# Altium project Speedometer_Tech.PrjPcb (part 1 of 2)
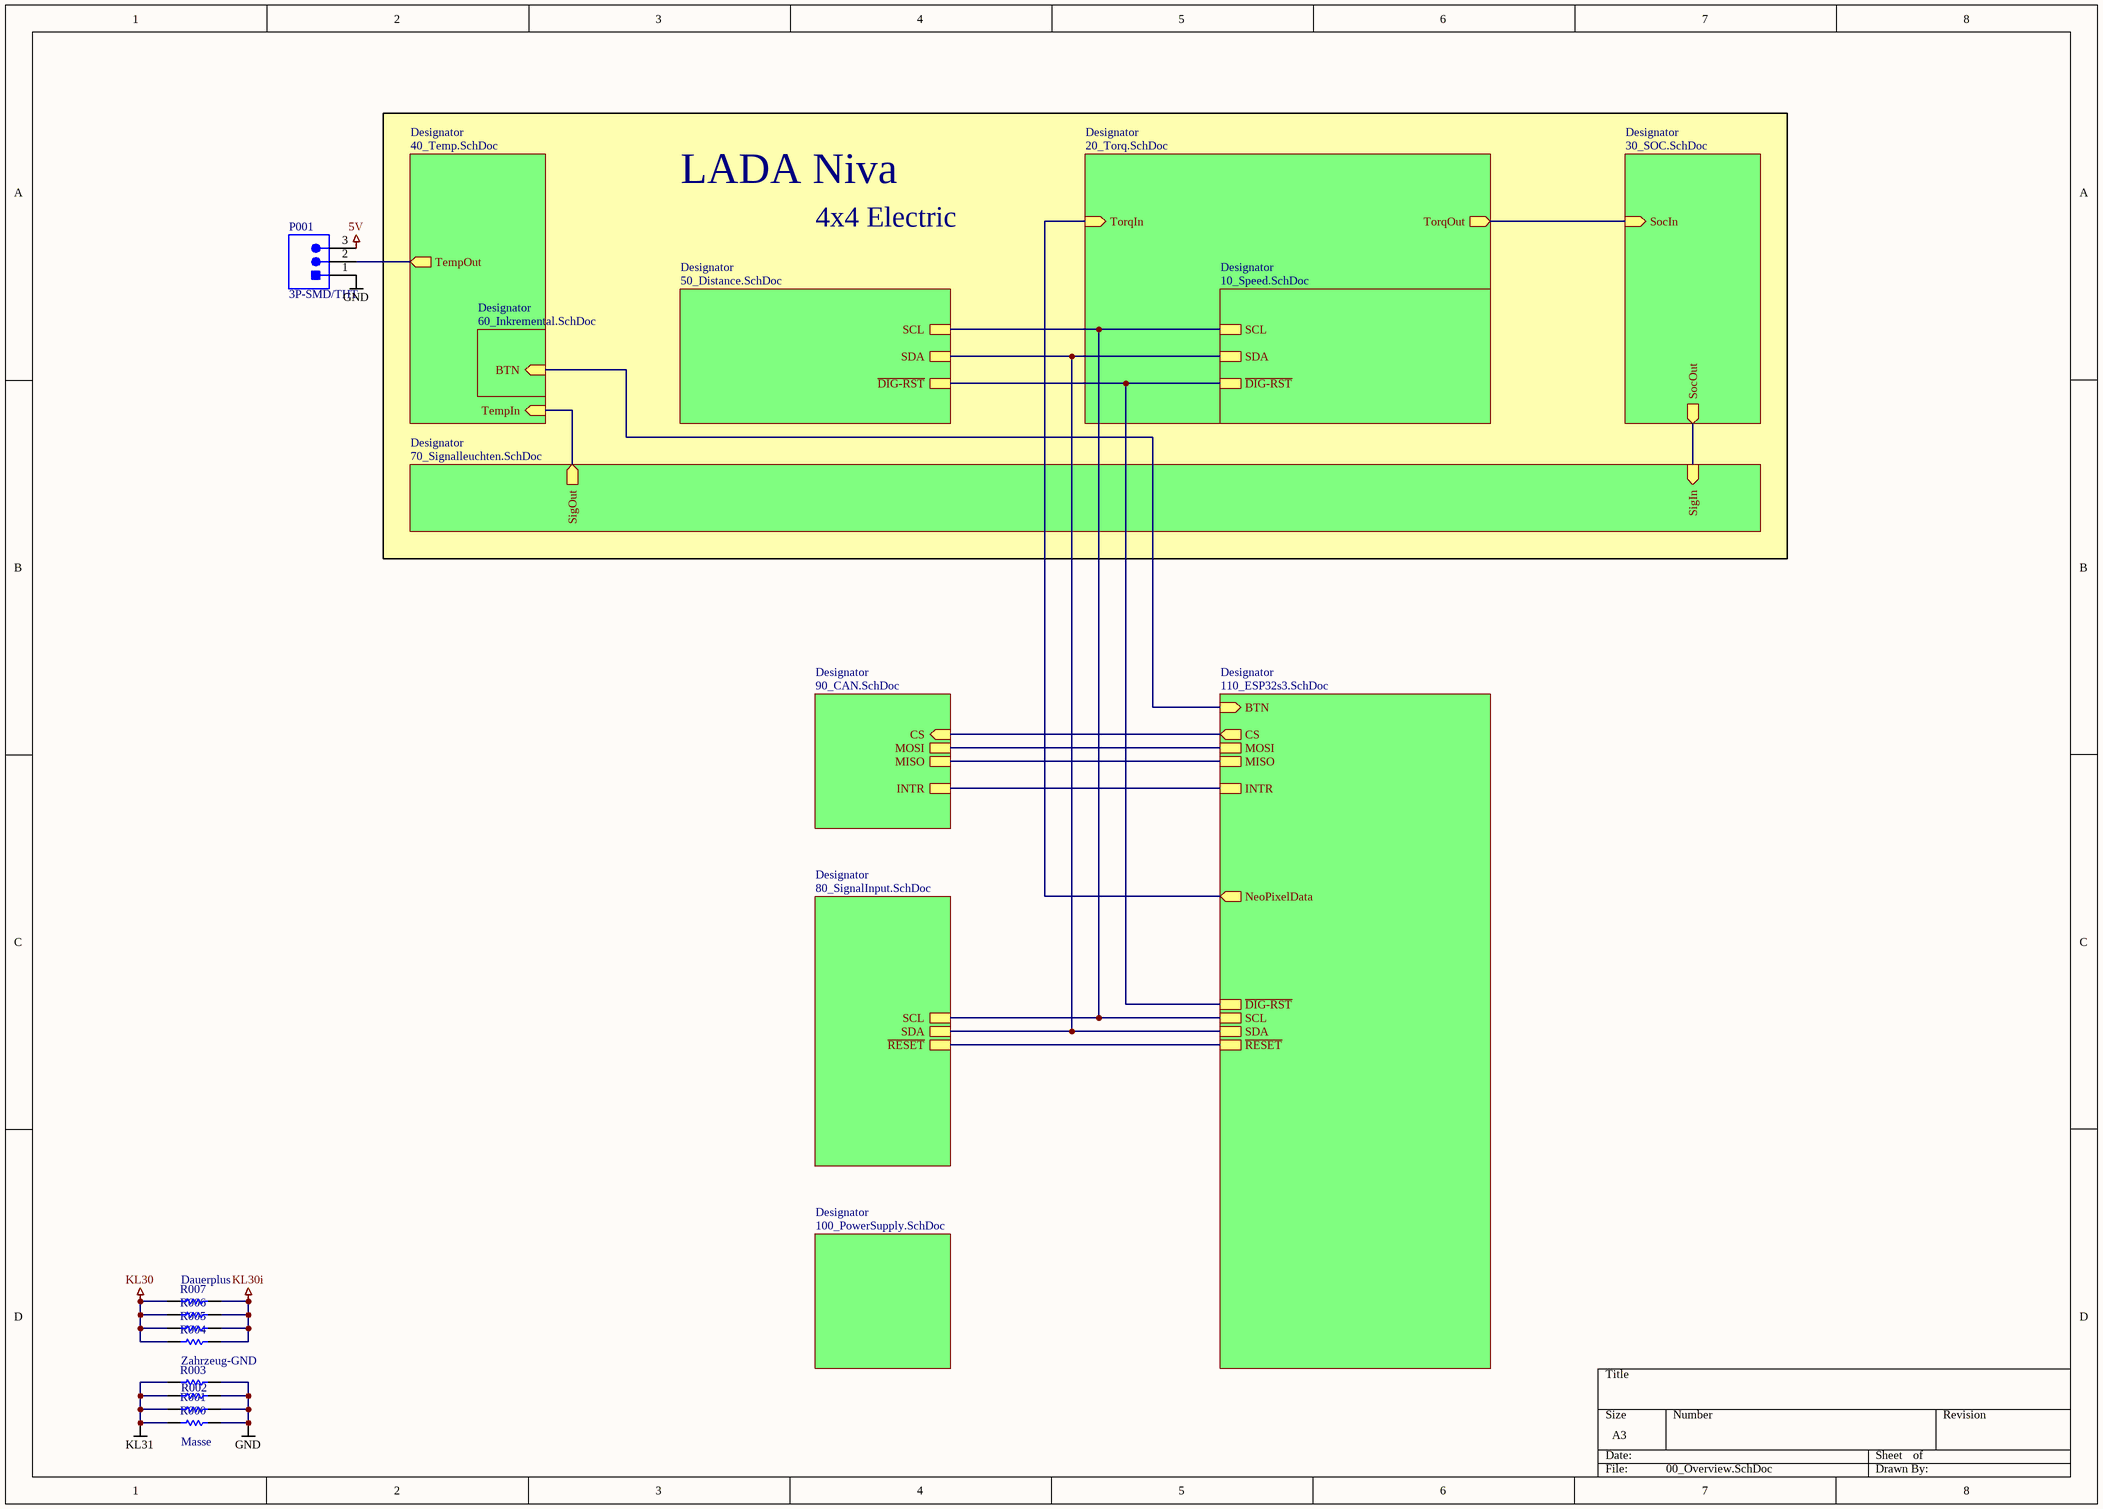
[diagram p0: 00_Overview.SchDoc]
12 sheets, 234 parts. Net scope: hierarchical (ports join the sheet entries above them; power ports are global).
Board file: Speedometer_Tech.PcbDoc
Sheets:
  00_Overview.SchDoc
    Designator = 110_ESP32s3.SchDoc
    Designator = 20_Torq.SchDoc
    Designator = 10_Speed.SchDoc
    Designator = 30_SOC.SchDoc
    Designator = 40_Temp.SchDoc
    Designator = 70_Signalleuchten.SchDoc
    Designator = 50_Distance.SchDoc
    Designator = 60_Inkremental.SchDoc
    Designator = 80_SignalInput.SchDoc
    Designator = 100_PowerSupply.SchDoc
    Designator = 90_CAN.SchDoc

## Sheet 00_Overview.SchDoc
size A3; SheetNumber: 1; SheetTotal: 11

### Parts
P001  3P-SMD/THT  [3P-SMD/THT]
R000  RC0603JR-070RL  [RESC1608X55X25ML10T15]  (value not drawn)
R001  RC0603JR-070RL  [RESC1608X55X25ML10T15]  (value not drawn)
R002  RC0603JR-070RL  [RESC1608X55X25ML10T15]  (value not drawn)
R003  RC0603JR-070RL  [RESC1608X55X25ML10T15]  (value not drawn)
R004  RC0603JR-070RL  [RESC1608X55X25ML10T15]  (value not drawn)
R005  RC0603JR-070RL  [RESC1608X55X25ML10T15]  (value not drawn)
R006  RC0603JR-070RL  [RESC1608X55X25ML10T15]  (value not drawn)
R007  RC0603JR-070RL  [RESC1608X55X25ML10T15]  (value not drawn)

### Sub-sheets
Designator = 110_ESP32s3.SchDoc: CS (out), INTR, MOSI, MISO, SCL, SDA, ~{RESET}, NeoPixelData (out), ~{DIG-RST}, BTN (in)
Designator = 20_Torq.SchDoc: TorqIn (in), TorqOut (out)
Designator = 10_Speed.SchDoc: SCL, SDA, ~{DIG-RST}
Designator = 30_SOC.SchDoc: SocIn (in), SocOut (out)
Designator = 40_Temp.SchDoc: TempOut (out), TempIn (in)
Designator = 70_Signalleuchten.SchDoc: SigIn (in), SigOut (out)
Designator = 50_Distance.SchDoc: SCL, SDA, ~{DIG-RST}
Designator = 60_Inkremental.SchDoc: BTN (in)
Designator = 80_SignalInput.SchDoc: SCL, SDA, ~{RESET}
Designator = 100_PowerSupply.SchDoc: no entries
Designator = 90_CAN.SchDoc: CS (in), INTR, MOSI, MISO

### Nets
5V: P001.3
GND: P001.1 R000.2 R001.2 R002.2 R003.2
KL30: R004.1 R005.1 R006.1 R007.1
KL30i: R004.2 R005.2 R006.2 R007.2
KL31: R000.1 R001.1 R002.1 R003.1
CS: sheet Designator/CS, sheet Designator/CS
~{DIG-RST}: sheet Designator/~{DIG-RST}, sheet Designator/~{DIG-RST}, sheet Designator/~{DIG-RST}
MISO: sheet Designator/MISO, sheet Designator/MISO
MOSI: sheet Designator/MOSI, sheet Designator/MOSI
SCL: sheet Designator/SCL, sheet Designator/SCL, sheet Designator/SCL, sheet Designator/SCL
SDA: sheet Designator/SDA, sheet Designator/SDA, sheet Designator/SDA, sheet Designator/SDA
NetP001_2: P001.2 ; sheet Designator/TempOut
NetQ1104_3: sheet Designator/~{RESET}, sheet Designator/~{RESET}
NetR600_2: sheet Designator/BTN, sheet Designator/BTN
NetU400_1: sheet Designator/TempIn, sheet Designator/SigOut
NetU700_1: sheet Designator/SocOut, sheet Designator/SigIn
NetU901_12: sheet Designator/INTR, sheet Designator/INTR
NetU1100_22: sheet Designator/NeoPixelData, sheet Designator/TorqIn
(unnamed): sheet Designator/TorqOut, sheet Designator/SocIn

### Notes on the sheet
- LADA Niva
- 4x4 Electric
- (near R007) Dauerplus
- Zahrzeug-GND
- (near R000) Masse

### Library data of the parts
R000 R001 R002 R003 R004 R005 R006 R007 = CMP-2100-03667-1: Chip Resistor, 0 Ohm, +/- 5%, 0.1 W, -55 to 155 degC, 0603 (1608 Metric), RoHS, Tape and Reel; Manufacturer: Yageo; Temperature Coefficient: 200ppm/degreesC; Voltage Rating: 50V; Power Rating: 100mW; Resistance: 0mOhm; Width: 0.8mm; Max Operating Temperature: 155degC; Tolerance: 5%; Package Reference: 0603; Height: 0.45mm; Depth: 0.8mm; Package Description: 2-Pin Surface Mount Device, Body 1.6 x 0.8 mm; Termination: SMD/SMT; Package Quantity: 5000; Case/Package: 0603; Case Code (Imperial): 0603; Radiation Hardening: No; Number of Pins: 2; Length: 1.6mm; Lead Free: LeadFree; Voltage Rating (DC): 50V; Military Standard: Not; Datasheet URL: http://www.yageo.com/NewPortal/yageodocoutput?fileName=/pdf/R-Chip/PYu-RC_Group_51_RoHS_L_5.pdf; Manufacturer URL: http://www.yageo.com/; Packaging: TapeandReel; Case Code (Metric): 1608; Min Operating Temperature: -55degC; Composition: ThickFilm; RoHSCompliant: true; Contact Plating: Tin; Datasheet Version: Rev. 5, 10/2016; REACH SVHC: NoSVHC

## Sheet 110_ESP32s3.SchDoc
size A4; SheetNumber: 12; SheetTotal: 12
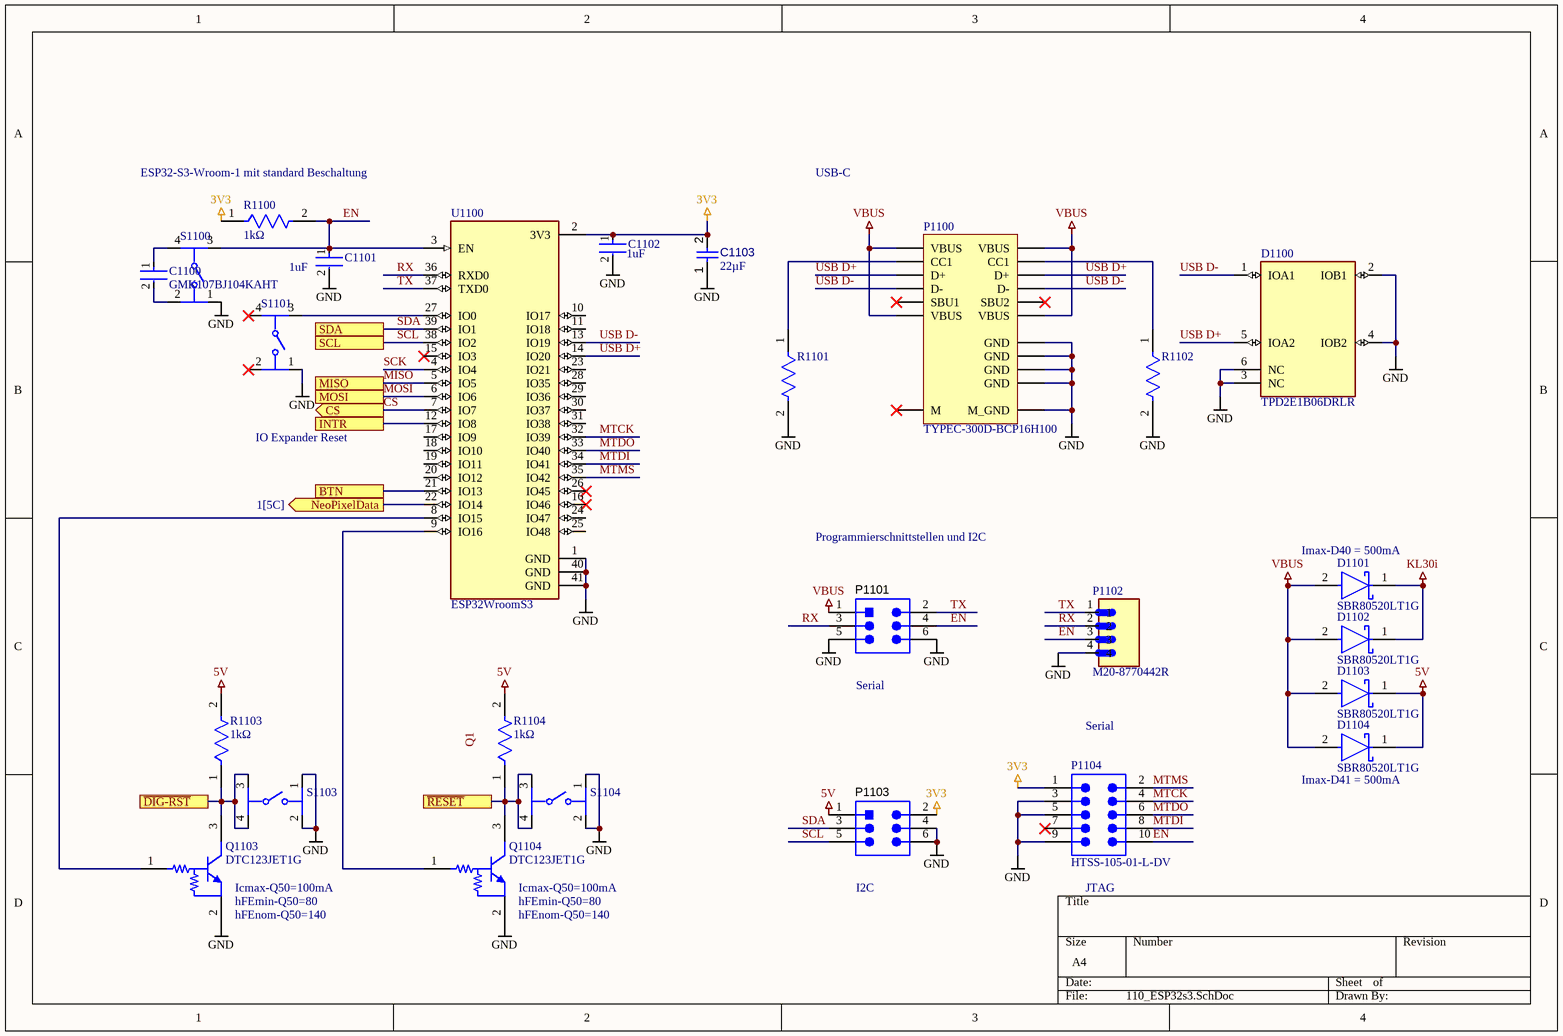
[diagram p1: 110_ESP32s3.SchDoc]

### Parts
C1100  GMK107BJ104KAHT  [FP-0603-L_1_6_0_1-W_0_8_0-IPC_B]
C1101  1uF  [FP-CGA3E-0_3-0_1-MFG]
C1102  1uF  [FP-CGA3E-0_3-0_1-MFG]
C1103  value 22µF  [CAPC0805(2012)145_L]  (hidden comment: Capacitor 22µF +/-40% 16V 0805)
D1100  TPD2E1B06DRLR  [FP-DRL0006A-MFG]
D1101  SBR80520LT1G  [FP-425-04-MFG]
D1102  SBR80520LT1G  [FP-425-04-MFG]
D1103  SBR80520LT1G  [FP-425-04-MFG]
D1104  SBR80520LT1G  [FP-425-04-MFG]
P1100  TYPEC-300D-BCP16H100  [TYPEC-300D-BCP16H100-Footprint-1]
P1101  5-146130-2  [TECO-5-146130-2_V]  (value not drawn)
P1102  M20-8770442R  [HARWIN_M20-8770442R]
P1103  5-146130-2  [TECO-5-146130-2_V]  (value not drawn)
P1104  HTSS-105-01-L-DV  [SMTC-HTSS-105-01-X-DV]
Q1103  DTC123JET1G  [ONSC-SC-75-3-463-01_V]
Q1104  DTC123JET1G  [ONSC-SC-75-3-463-01_V]
R1100  1kΩ  [FP-CRCW0603-e3-MFG]
R1101  CRCW06035K10FKEA  [FP-CRCW0603-e3-IPC_C]  (value not drawn)
R1102  CRCW06035K10FKEA  [FP-CRCW0603-e3-IPC_C]  (value not drawn)
R1103  1kΩ  [FP-CRCW0603-e3-MFG]
R1104  1kΩ  [FP-CRCW0603-e3-MFG]
S1100  (no value)  [FP-PTS645SM43SMTR92LFS-MFG]
S1101  (no value)  [FP-PTS645SM43SMTR92LFS-MFG]
S1103  (no value)  [FP-PTS645SM43SMTR92LFS-MFG]
S1104  (no value)  [FP-PTS645SM43SMTR92LFS-MFG]
U1100  ESP32WroomS3  [ESP32WroomS3]

### Ports
BTN (see 1[5B], 7[4C]), CS (out, see 1[5B], 10[3C]), INTR (see 1[5C], 10[4C]), MISO (see 1[5C], 10[4C]), MOSI (see 1[5B], 10[3D]), NeoPixelData (out, see 1[5C]), SCL (see 1[5C], 2[1C], 6[1C], 9[6B]), SDA (see 1[5C], 2[1C], 6[1C], 9[6B]), ~{DIG-RST} (see 1[5C], 2[1D], 6[1D]), ~{RESET} (see 1[5C], 9[6B])

### Nets
3V3: C1102.1 C1103.2 P1103.2 P1104.1 R1100.1 U1100.2(3V3)
5V: D1103.1(C) D1104.1(C) P1103.1 R1103.2 R1104.2
GND: C1101.2 C1102.2 C1103.1 D1100.2(IOB1) D1100.3(NC) D1100.4(IOB2) D1100.6(NC) P1100.A1(GND) P1100.A12(GND) P1100.B1(GND) P1100.B12(GND) P1100.M_GND P1101.5 P1101.6 P1102.4 P1103.4 P1103.6 P1104.3 P1104.5 P1104.9 Q1103.2(E) Q1104.2(E) R1101.2 R1102.2 S1100.1 S1101.1 S1103.1 S1103.2 S1104.1 S1104.2 U1100.1(GND) U1100.40(GND) U1100.41(GND)
KL30i: D1101.1(C) D1102.1(C)
VBUS: D1101.2(A) D1102.2(A) D1103.2(A) D1104.2(A) P1100.A4(VBUS) P1100.A9(VBUS) P1100.B4(VBUS) P1100.B9(VBUS) P1101.1
CS: U1100.7(IO7) ; port CS
~{DIG-RST}: Q1103.3(C) R1103.1 S1103.3 S1103.4 ; port ~{DIG-RST}
EN: C1101.1 P1101.4 P1102.3 P1104.10 R1100.2 S1100.3 U1100.3(EN)
MISO: U1100.5(IO5) ; port MISO
MOSI: U1100.6(IO6) ; port MOSI
MTCK: P1104.4 U1100.32(IO39)
MTDI: P1104.8 U1100.34(IO41)
MTDO: P1104.6 U1100.33(IO40)
MTMS: P1104.2 U1100.35(IO42)
RX: P1101.3 P1102.2 U1100.36(RXD0)
SCK: U1100.4(IO4)
SCL: P1103.5 U1100.38(IO2) ; port SCL
SDA: P1103.3 U1100.39(IO1) ; port SDA
TX: P1101.2 P1102.1 U1100.37(TXD0)
USB D+: D1100.5(IOA2) P1100.A6(D+) P1100.B6(D+) U1100.14(IO20)
USB D-: D1100.1(IOA1) P1100.A7(D-) P1100.B7(D-) U1100.13(IO19)
NetC1100_1: C1100.1 S1100.4
NetC1100_2: C1100.2 S1100.2
NetP1100_A5: P1100.A5(CC1) R1101.1
NetP1100_B5: P1100.B5(CC1) R1102.1
NetQ1103_1: Q1103.1(B) U1100.8(IO15)
NetQ1104_1: Q1104.1(B) U1100.9(IO16)
NetQ1104_3: Q1104.3(C) R1104.1 S1104.3 S1104.4 ; port ~{RESET}
NetR600_2: U1100.21(IO13) ; port BTN
NetS1101_3: S1101.3 U1100.27(IO0)
NetU901_12: U1100.12(IO8) ; port INTR
NetU1100_22: U1100.22(IO14) ; port NeoPixelData

Not connected (* = marked no-connect by the designer): P1100 A8(SBU1)* B8(SBU2)* M*; P1104 7*; S1101 2* 4*; U1100 10(IO17) 11(IO18) 15(IO3)* 16(IO46)* 17(IO9) 18(IO10) 19(IO11) 20(IO12) 23(IO21) 24(IO47) 25(IO48) 26(IO45)* 28(IO35) 29(IO36) 30(IO37) 31(IO38)

### Notes on the sheet
- (near R1100) ESP32-S3-Wroom-1 mit standard Beschaltung
- USB-C
- IO Expander Reset
- Programmierschnittstellen und I2C
- (near D1101) Imax-D40 = 500mA
- (near P1101) Serial
- Serial
- (near D1104) Imax-D41 = 500mA
- (near Q1103) Icmax-Q50=100mA
- (near Q1103) hFEmin-Q50=80
- (near Q1103) hFEnom-Q50=140
- (near Q1104) Icmax-Q50=100mA
- (near Q1104) hFEmin-Q50=80
- (near Q1104) hFEnom-Q50=140
- (near P1103) I2C
- (near P1104) JTAG
- Labels drawn without touching a wire or pin: Q1

### Library data of the parts
C1100 = CMP-14477-002194-3: Ceramic Capacitor Automotive 0.1uF ±10% 35V X5R 0603; NexarPartId: 29103042; Capacitance: 100nF; Packaging: Digi-Reel®; Height: 900µm; Width: 800µm; Thickness: 889µm; Min Operating Temperature: -55°C; Termination: SMD/SMT; Mount: Surface Mount; Ratings: AEC-Q200; Halogen Free: Halogen Free; Tolerance: 10%; Max Operating Temperature: 85°C; Case Code (Metric): 1608; Case/Package: 0603; Lead Free: Lead Free; Case Code (Imperial): 0603; Length: 1.6002mm; Voltage Rating: 35V; Voltage Rating (DC): 35V; Dielectric: X5R; Min Width: 700µm; Min Length: 1.5mm; Max Length: 1.7mm; Material: Ceramic; Min Thickness: 700µm; Max Thickness: 900µm; RoHS: Compliant; Max Width: 900µm
C1101 C1102 = CMP-08246-002551-1: Cap Ceramic 1uF 35V X7R 10% Pad SMD 0603 +125°C Automotive T/R / CGA3E1X7R1V105K080AC; Termination: SMD/SMT; Packaging: Tape and Reel; Capacitance: 1uF; Tolerance: 10%; Mount: Surface Mount; Thickness: 0.035inch; Case Code (Imperial): 0603; Voltage Rating: 35V; Case/Package: 0603; Case Code (Metric): 1608; Dielectric: X7R; Width: 0.031inch; Length: 0.063inch; Min Operating Temperature: -55°C; Weight: 7.1E-05oz; Max Operating Temperature: 125°C; Voltage Rating (DC): 35V; Height: 0.8mm; Ratings: AEC-Q200; Package Quantity: 4000
C1103 = CMP-001-00081-4: Chip Capacitor, 22µF +/-40%, 16V, 0805, Thickness 1.45 mm; Tolerance: 5%; Voltage Rating: 16V; Mounting Technology: SMT; Pins: 2; Max Operating Temperature: 85°C; Case/Package: 0805; Min Operating Temperature: -55°C
D1100 = CMP-04985-000003-1: TVS DIODE 5.5V 15V 6SOT; Manufacturer: Texas Instruments; Peak Pulse Power: 35W; Peak Pulse Current: 2.5A; Direction: Bidirectional; Standoff Height: 0mm; Interface: I2C,USB,LVDS,Other; Number Of Channels: 2; Breakdown Voltage: 7V; Ambient Temperature Range High: +125°C; Package: DRL0006A; Automotive: No; Lead Free: Yes; Temperature Range Low: -40°C; Reverse Standoff Voltage: 5.5V; Clamping Voltage: 15V; Mouser Description: ESD Suppressors / TVS Diodes 2-CH system level ESD protect device; Temperature Range High: +125°C; Device Class L1: Circuit Protection; ComponentLink2Description: Datasheet; RoHS: TRUE; Ambient Temperature Range Low: -40°C; Height: 0.6mm; Device Class L3: unset; Device Class L2: ESD and Circuit Protection ICs; Temperature: -40°C to +125°C; Octopart: https://octopart.com/tpd2e1b06drlr-texas+instruments-30488860; ComponentLink2URL: http://www.ti.com/lit/ds/symlink/tpd2e1b06.pdf; Category: Diode; Manufacturer Part Number: TPD2E1B06DRLR; Digikey Description: TVS DIODE 5.5V 15V 6SOT
D1101-D1104 = CMP-1055-00426-2: DIODE SCHOTTKY 20V 500MA SOD123; Forward Voltage: 385mV; Element Configuration: Single; Max Forward Surge Current (Ifsm): 5.5A; Peak Reverse Current: 250uA; Min Operating Temperature: -65°C; Case/Package: SOD-123-2; Halogen Free: Halogen Free; Number of Pins: 2; Max Operating Temperature: 125°C; Average Rectified Current: 500mA; Weight: 0.000363oz; Height: 1.17mm; Reverse Voltage (DC): 20V; Forward Current: 500mA; Max Reverse Voltage (DC): 20V; Width: 1.6mm; Termination: SMD/SMT; Max Repetitive Reverse Voltage (Vrrm): 20V; Package Quantity: 3000; Length: 2.69mm; Lead Free: Lead Free; Peak Non-Repetitive Surge Current: 5.5A; Packaging: Tape and Reel
P1100 = CMP-002-00081-3: Vertical USB Type C Connector
P1101 P1103 = CMP-1684-00011-1: Male Header, Pitch 2.54 mm, 2 x 3 Position, Height 8.13 mm, -65 to 125 degC, RoHS, Tube; Max Supply Voltage: 5.5 V; Min Supply Voltage: 4.5 V; Nominal Supply Voltage: 5 V; Min Operating Temperature: -40 degC; ComponentLink1URL: http://www.te.com/; ComponentLink2Description: Datasheet; Pins: 3; Max Operating Temperature: 150 degC; PackageDescription: Male Header, Pitch 2.54 mm, 2 x 3 Position, Height 8.13 mm; Package Quantity: 3000; PackageReference: 5-146130-2; DatasheetVersion: Oct-15; ComponentLink1Description: Manufacturer URL; Radiation Hardening: No; Mount: Surface Mount; RoHSCompliant: true; Packaging: Tape and Reel; ComponentLink2URL: http://www.te.com/commerce/DocumentDelivery/DDEController?Action=showdoc&DocId=Customer+Drawing%7F146130%7FM%7Fpdf%7FEnglish%7FENG_CD_146130_M.pdf%7F5-146130-2
P1102 = M20-8770442R: Connector Header Surface Mount 4 position 0.100 (2.54mm); MF: Harwin Inc.; Package: None; Price: None; Check_prices: https://www.snapeda.com/parts/M20-8770442R/Harwin+Inc./view-part/?ref=eda; Value: *; SnapEDA_Link: https://www.snapeda.com/parts/M20-8770442R/Harwin+Inc./view-part/?ref=snap; MP: M20-8770442R; Availability: In Stock; Purchase-URL: https://pricing.snapeda.com/search?q=M20-8770442R&ref=eda
P1104 = CMP-1024-00042-1: Shrouded .025" SQ Post Header, Surface Mount, Vertical, -55 to 125 degC, 2.54 mm Pitch, 10-Pin, Male, RoHS; Manufacturer: Samtec; Pitch: 2.54 mm; ComponentLink1URL: http://www.samtec.com; Mounting Technology: Surface Mount; ComponentLink3URL: http://www.samtec.com/documents/webfiles/cpdf/HTSS-1XX-01-XX-DV-X-XX-X-XX-MKT.pdf; ComponentLink2URL: http://www.samtec.com/documents/webfiles/pdf/htss.pdf; ComponentLink3Description: Package Specification; Orientation: Vertical; PackageDescription: High Temp Top Shroud; ComponentLink2Description: Datasheet; PackageVersion: Z, 7/2001; ComponentLink1Description: Manufacturer URL; Temperature Range: -55 to 125 degC; RoHS: True; PackageReference: HTSS-105-01-X-DV; DatasheetVersion: F-214; PartNumber: HTSS-105-01-L-DV
Q1103 Q1104 = CMP-0630-00201-1: Digital Transistor (BRT), R1=2.2 kOhm, R2=47 kOhm, NPN Transistor, 3-Pin SC-75, Pb-Free, Tape and Reel; Manufacturer: On Semiconductor; V(BR)CEO Min (V): 50; hFE Min: 80; R1/R2 Typ: 0.047; IC Continuous (A): 0.1; ComponentLink1URL: http://www.onsemi.com/; ComponentLink2URL: http://www.onsemi.cn/pub_link/Collateral/DTC123J-D.PDF; DatasheetVersion: Rev. 1; Mounting Technology: Surface Mount; ComponentLink2Description: Datasheet; PartNumber: DTC123JET1G; PackageDescription: 3-Pin Small Outline Transistor, Body 1.6 x 0.8 mm, Pitch 0.5 mm; Polarity: NPN; PackageVersion: Rev. F, 07/2005; ComponentLink3Description: Package Specification; PackageReference: SC-75-3-463-01; Packing: Tape and Reel; ComponentLink3URL: http://www.onsemi.com/pub_link/Collateral/463-01.PDF; ComponentLink1Description: Manufacturer URL; RoHS: TRUE
R1100 R1103 R1104 = CMP-1666-00003-5: RES Thick Film, 1kΩ, 1%, 0.1W, 100ppm/°C, 0603, CRCW06031K00FKEA; Max Power Dissipation: 100mW; Voltage Rating: 75V; Resistance: 1kR; Max Operating Temperature: 155°C; Number of Pins: 2; Case Code (Imperial): 0603; Width: 0.033inch; Power Rating: 100mW; Number of Terminations: 2; Package Quantity: 10; Weight: 7.1E-05oz; Tolerance: 1%; Temperature Coefficient: 100ppm/°C; Military Standard: Not; Mount: Surface Mount; Voltage Rating (DC): 75V; Depth: 0.85mm; Composition: Thick Film; Radiation Hardening: No; Termination: SMD/SMT; Length: 1.55mm; Case Code (Metric): 1608; Contact Plating: Tin; Min Operating Temperature: -55°C; Packaging: Tape and Reel; Height: 0.45mm; Lead Free: Lead Free; Case/Package: 0603; Features: Automotive AEC-Q200
R1101 R1102 = CMP-1012-00590-3: RES Thick Film, 5.1kΩ, 1%, 0.1W, 100ppm/°C, 0603; Power Rating: 100mW; Voltage Rating (DC): 75V; Resistance: 5.1kR; Width: 0.85mm; Depth: 0.85mm; Military Standard: Not; Package Quantity: 5000; Case Code (Metric): 1608; Length: 1.55mm; Weight: 7.1E-05oz; Packaging: Tape and Reel; Temperature Coefficient: 100ppm/°C; Case Code (Imperial): 0603; Lead Free: Lead Free; Radiation Hardening: No; Contact Plating: Tin; Composition: Thick Film; Max Operating Temperature: 155°C; Termination: SMD/SMT; Case/Package: 0603; Min Operating Temperature: -55°C; Tolerance: 1%; Voltage Rating: 75V; Mount: Surface Mount; Height: 0.45mm
S1100 S1101 S1103 S1104 = CMP-2000-05160-2: SWITCH TACTILE SPST-NO 0.05A 12V / PTS645SM43SMTR92LFS; Contact Resistance: 100mR; Throw Configuration: SPST; Illumination Type: Non-Illuminated; Mechanical Life: 100000Cycles; Current Rating: 50mA; Switch Function: Off-Mom; Actuator Length: 0.85mm; Actuator Material: Nylon; Actuator Type: Standard; Operating Force: 160gf; Min Operating Temperature: -20°C; REACH SVHC: No SVHC; Termination: Gull Wing; Case/Package: SMD/SMT; Packaging: Tape and Reel; Mount: Surface Mount; Voltage Rating (DC): 12V; Orientation: Straight; Lead Free: Lead Free; Contact Material: Silver; Color: Black; Max Current Rating: 50mA; Contact Plating: Silver; Depth: 9mm; Package Quantity: 1; Max Voltage Rating (DC): 12V; Length: 6mm; Max Operating Temperature: 60°C
U1100 = CMP-017-000002-1: Design Item ID: ESP32WroomS3; Source: Schaltdose.SchLib

## Sheet 20_Torq.SchDoc
size A3; SheetNumber: 3; SheetTotal: 12
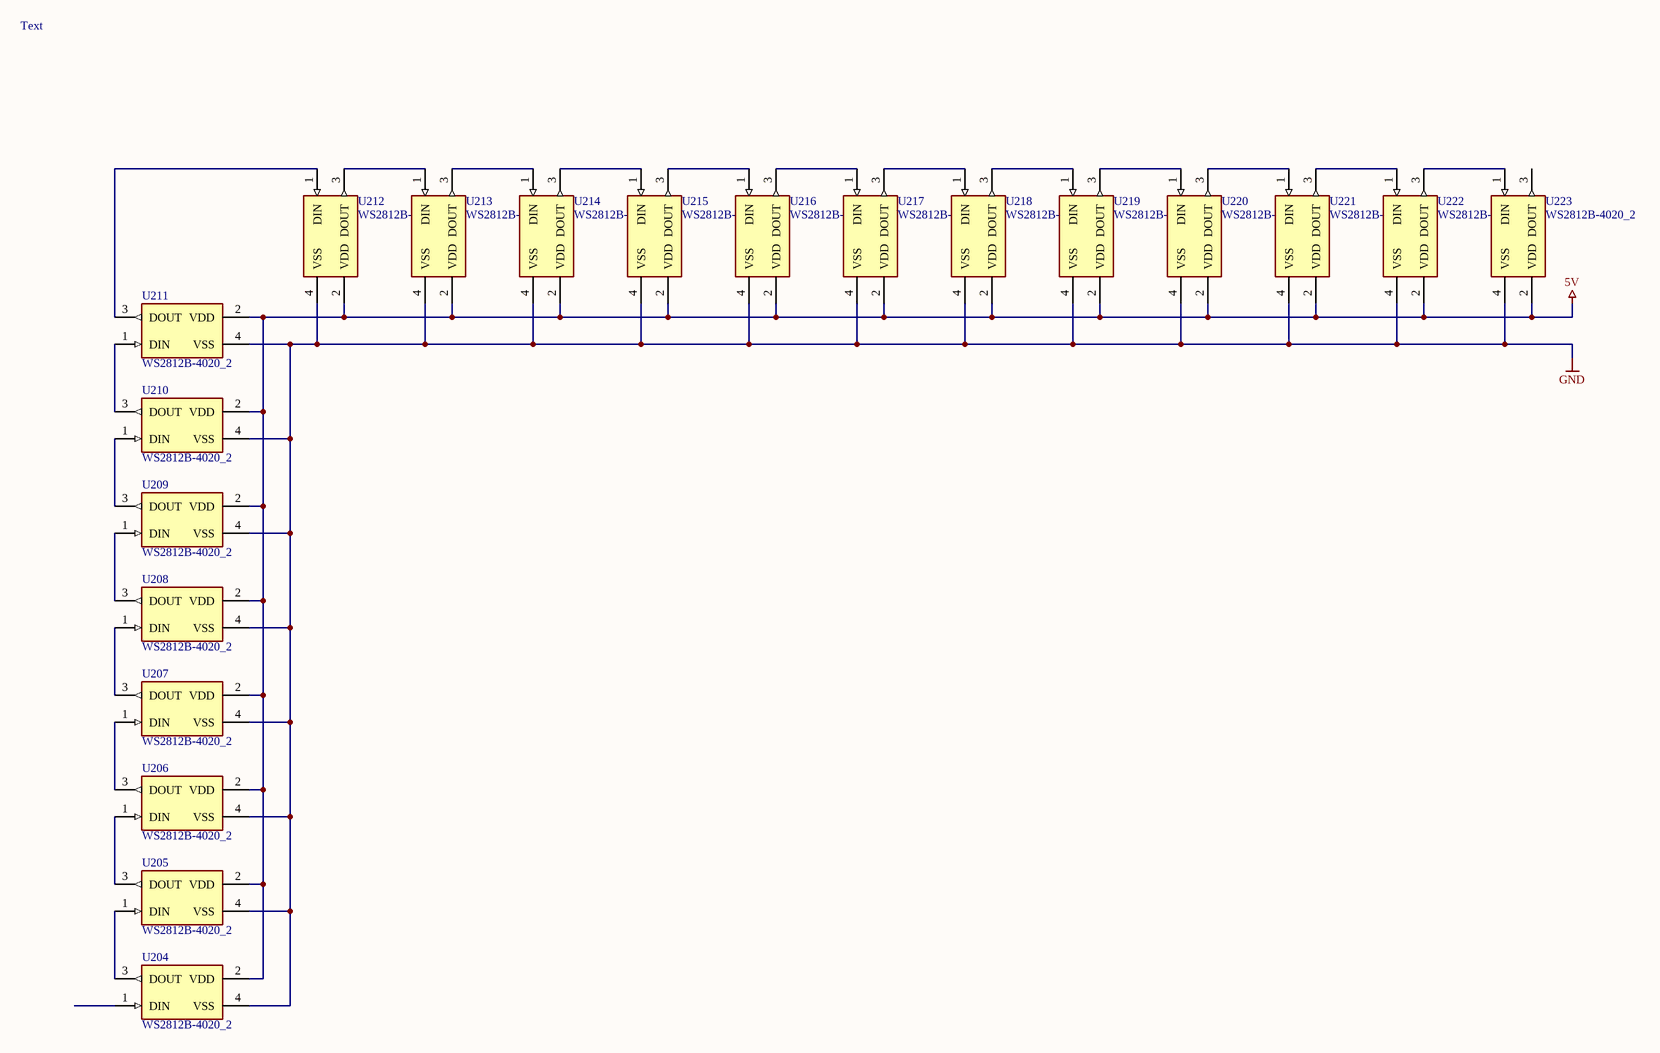
[diagram p2: 20_Torq.SchDoc]

### Parts
U204  WS2812B-4020_2  [LED_WS2812B-4020]
U205  WS2812B-4020_2  [LED_WS2812B-4020]
U206  WS2812B-4020_2  [LED_WS2812B-4020]
U207  WS2812B-4020_2  [LED_WS2812B-4020]
U208  WS2812B-4020_2  [LED_WS2812B-4020]
U209  WS2812B-4020_2  [LED_WS2812B-4020]
U210  WS2812B-4020_2  [LED_WS2812B-4020]
U211  WS2812B-4020_2  [LED_WS2812B-4020]
U212  WS2812B-4020_2  [LED_WS2812B-4020]
U213  WS2812B-4020_2  [LED_WS2812B-4020]
U214  WS2812B-4020_2  [LED_WS2812B-4020]
U215  WS2812B-4020_2  [LED_WS2812B-4020]
U216  WS2812B-4020_2  [LED_WS2812B-4020]
U217  WS2812B-4020_2  [LED_WS2812B-4020]
U218  WS2812B-4020_2  [LED_WS2812B-4020]
U219  WS2812B-4020_2  [LED_WS2812B-4020]
U220  WS2812B-4020_2  [LED_WS2812B-4020]
U221  WS2812B-4020_2  [LED_WS2812B-4020]
U222  WS2812B-4020_2  [LED_WS2812B-4020]
U223  WS2812B-4020_2  [LED_WS2812B-4020]

### Nets
5V: U204.2(VDD) U205.2(VDD) U206.2(VDD) U207.2(VDD) U208.2(VDD) U209.2(VDD) U210.2(VDD) U211.2(VDD) U212.2(VDD) U213.2(VDD) U214.2(VDD) U215.2(VDD) U216.2(VDD) U217.2(VDD) U218.2(VDD) U219.2(VDD) U220.2(VDD) U221.2(VDD) U222.2(VDD) U223.2(VDD)
GND: U204.4(VSS) U205.4(VSS) U206.4(VSS) U207.4(VSS) U208.4(VSS) U209.4(VSS) U210.4(VSS) U211.4(VSS) U212.4(VSS) U213.4(VSS) U214.4(VSS) U215.4(VSS) U216.4(VSS) U217.4(VSS) U218.4(VSS) U219.4(VSS) U220.4(VSS) U221.4(VSS) U222.4(VSS) U223.4(VSS)
NetU204_3: U204.3(DOUT) U205.1(DIN)
NetU205_3: U205.3(DOUT) U206.1(DIN)
NetU206_3: U206.3(DOUT) U207.1(DIN)
NetU207_3: U207.3(DOUT) U208.1(DIN)
NetU208_3: U208.3(DOUT) U209.1(DIN)
NetU209_3: U209.3(DOUT) U210.1(DIN)
NetU210_3: U210.3(DOUT) U211.1(DIN)
NetU211_3: U211.3(DOUT) U212.1(DIN)
NetU212_3: U212.3(DOUT) U213.1(DIN)
NetU213_3: U213.3(DOUT) U214.1(DIN)
NetU214_3: U214.3(DOUT) U215.1(DIN)
NetU215_3: U215.3(DOUT) U216.1(DIN)
NetU216_3: U216.3(DOUT) U217.1(DIN)
NetU217_3: U217.3(DOUT) U218.1(DIN)
NetU218_3: U218.3(DOUT) U219.1(DIN)
NetU219_3: U219.3(DOUT) U220.1(DIN)
NetU220_3: U220.3(DOUT) U221.1(DIN)
NetU221_3: U221.3(DOUT) U222.1(DIN)
NetU222_3: U222.3(DOUT) U223.1(DIN)

Not connected (* = marked no-connect by the designer): U204 1(DIN); U223 3(DOUT)

### Notes on the sheet
- Text

### Library data of the parts
U204-U223 = WS2812B-4020_2: 12mA RGB SMD,2x4mm Light Emitting Diodes; MF: Worldsemi; Price: None; MP: WS2812B-4020; Availability: Not in stock; SnapEDA_Link: https://www.snapeda.com/parts/WS2812B-4020/Worldsemi/view-part/?ref=snap; Check_prices: https://www.snapeda.com/parts/WS2812B-4020/Worldsemi/view-part/?ref=eda; Value: *; Package: Package

## Sheet 10_Speed.SchDoc
size A3; SheetNumber: 2; SheetTotal: 12
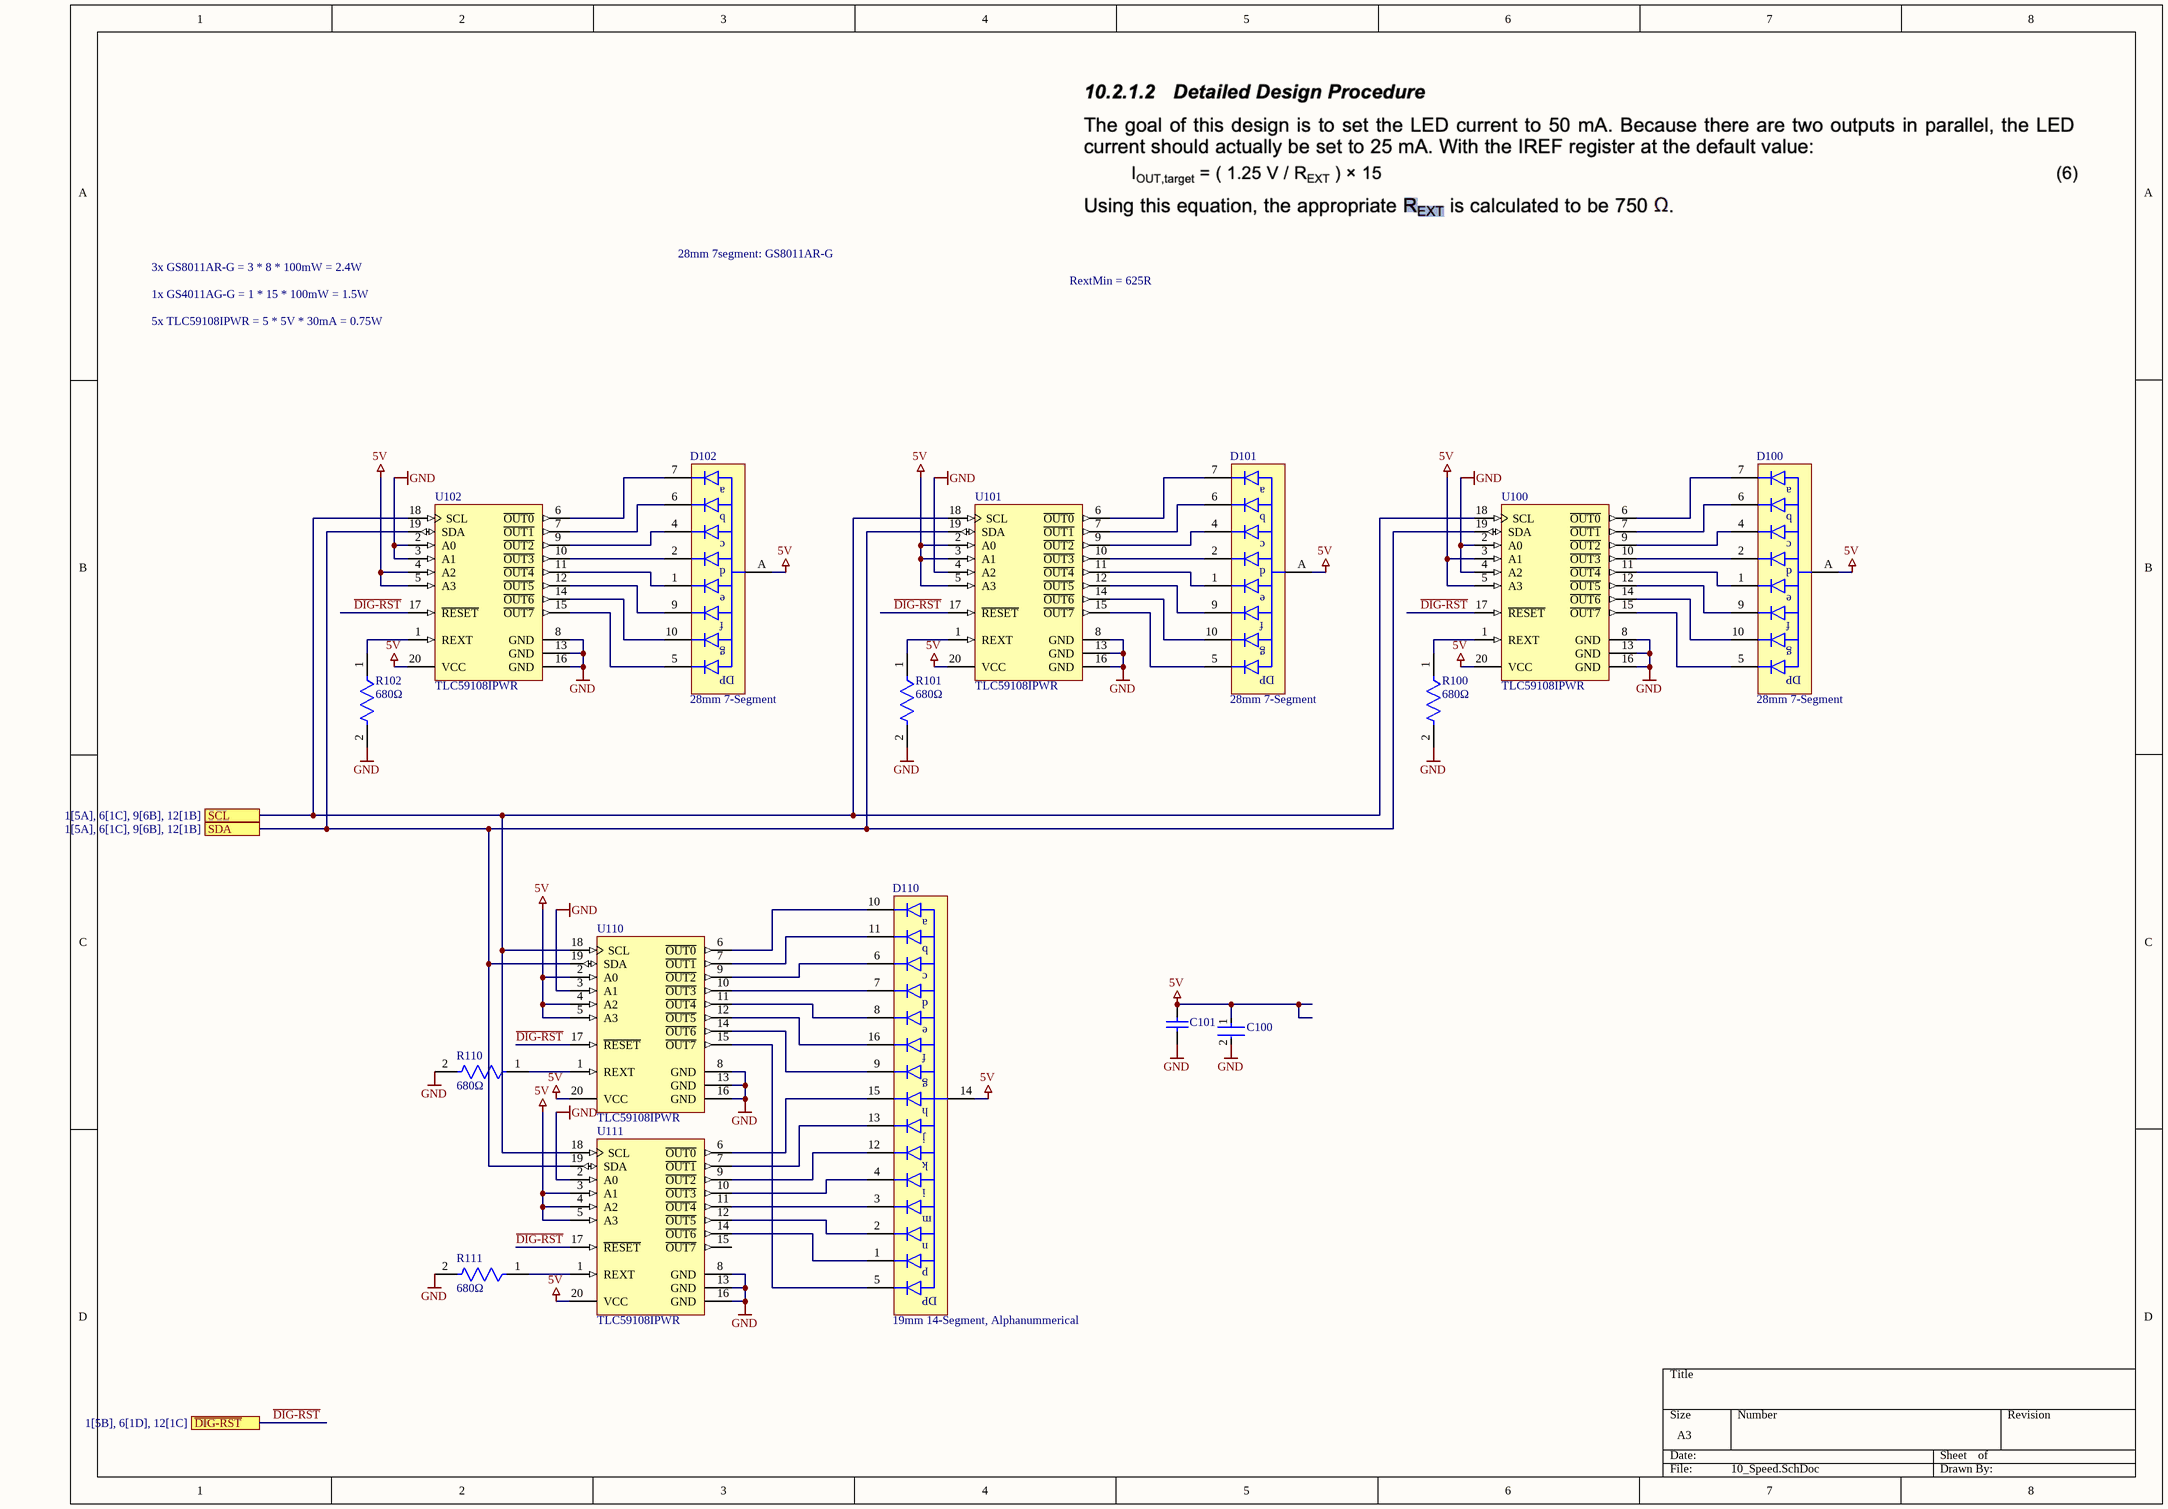
[diagram p3: 10_Speed.SchDoc]

### Parts
C100  GMK107BJ104KAHT  [FP-0603-L_1_6_0_1-W_0_8_0-IPC_B]  (value not drawn)
C101  CAP 47uF 10V 1206(3216)  [CAPC1206(3216)190_N]  (value not drawn)
D100  28mm 7-Segment  [GS8011AR-G]
D101  28mm 7-Segment  [GS8011AR-G]
D102  28mm 7-Segment  [GS8011AR-G]
D110  19mm 14-Segment, Alphanummerical  [GS4011AG-G]
R100  680Ω  [FP-CRCW0603-e3-IPC_A]
R101  680Ω  [FP-CRCW0603-e3-IPC_A]
R102  680Ω  [FP-CRCW0603-e3-IPC_A]
R110  680Ω  [FP-CRCW0603-e3-IPC_A]
R111  680Ω  [FP-CRCW0603-e3-IPC_A]
U100  TLC59108IPWR  [PW0020A_M]
U101  TLC59108IPWR  [PW0020A_M]
U102  TLC59108IPWR  [PW0020A_M]
U110  TLC59108IPWR  [PW0020A_M]
U111  TLC59108IPWR  [PW0020A_M]

### Ports
SCL (see 1[5A], 6[1C], 9[6B], 12[1B]), SDA (see 1[5A], 6[1C], 9[6B], 12[1B]), ~{DIG-RST} (see 1[5B], 6[1D], 12[1C])

### Nets
5V: C100.1 C101.2 D100.A D101.A D102.A D110.14 U100.3(A1) U100.5(A3) U100.20(VCC) U101.2(A0) U101.3(A1) U101.5(A3) U101.20(VCC) U102.4(A2) U102.5(A3) U102.20(VCC) U110.2(A0) U110.4(A2) U110.5(A3) U110.20(VCC) U111.3(A1) U111.4(A2) U111.5(A3) U111.20(VCC)
GND: C100.2 C101.1 R100.2 R101.2 R102.2 R110.2 R111.2 U100.2(A0) U100.4(A2) U100.8(GND) U100.13(GND) U100.16(GND) U101.4(A2) U101.8(GND) U101.13(GND) U101.16(GND) U102.2(A0) U102.3(A1) U102.8(GND) U102.13(GND) U102.16(GND) U110.3(A1) U110.8(GND) U110.13(GND) U110.16(GND) U111.2(A0) U111.8(GND) U111.13(GND) U111.16(GND)
~{DIG-RST}: U100.17(~{RESET}) U101.17(~{RESET}) U102.17(~{RESET}) U110.17(~{RESET}) U111.17(~{RESET}) ; port ~{DIG-RST}
SCL: U100.18(SCL) U101.18(SCL) U102.18(SCL) U110.18(SCL) U111.18(SCL) ; port SCL
SDA: U100.19(SDA) U101.19(SDA) U102.19(SDA) U110.19(SDA) U111.19(SDA) ; port SDA
NetD100_1: D100.1 U100.11(~{OUT4})
NetD100_2: D100.2 U100.10(~{OUT3})
NetD100_4: D100.4 U100.9(~{OUT2})
NetD100_5: D100.5 U100.15(~{OUT7})
NetD100_6: D100.6 U100.7(~{OUT1})
NetD100_7: D100.7 U100.6(~{OUT0})
NetD100_9: D100.9 U100.12(~{OUT5})
NetD100_10: D100.10 U100.14(~{OUT6})
NetD101_1: D101.1 U101.11(~{OUT4})
NetD101_2: D101.2 U101.10(~{OUT3})
NetD101_4: D101.4 U101.9(~{OUT2})
NetD101_5: D101.5 U101.15(~{OUT7})
NetD101_6: D101.6 U101.7(~{OUT1})
NetD101_7: D101.7 U101.6(~{OUT0})
NetD101_9: D101.9 U101.12(~{OUT5})
NetD101_10: D101.10 U101.14(~{OUT6})
NetD102_1: D102.1 U102.11(~{OUT4})
NetD102_2: D102.2 U102.10(~{OUT3})
NetD102_4: D102.4 U102.9(~{OUT2})
NetD102_5: D102.5 U102.15(~{OUT7})
NetD102_6: D102.6 U102.7(~{OUT1})
NetD102_7: D102.7 U102.6(~{OUT0})
NetD102_9: D102.9 U102.12(~{OUT5})
NetD102_10: D102.10 U102.14(~{OUT6})
NetD110_1: D110.1 U111.14(~{OUT6})
NetD110_2: D110.2 U111.12(~{OUT5})
NetD110_3: D110.3 U111.11(~{OUT4})
NetD110_4: D110.4 U111.10(~{OUT3})
NetD110_5: D110.5 U110.15(~{OUT7})
NetD110_6: D110.6 U110.9(~{OUT2})
NetD110_7: D110.7 U110.10(~{OUT3})
NetD110_8: D110.8 U110.11(~{OUT4})
NetD110_9: D110.9 U110.14(~{OUT6})
NetD110_10: D110.10 U110.6(~{OUT0})
NetD110_11: D110.11 U110.7(~{OUT1})
NetD110_12: D110.12 U111.9(~{OUT2})
NetD110_13: D110.13 U111.7(~{OUT1})
NetD110_15: D110.15 U111.6(~{OUT0})
NetD110_16: D110.16 U110.12(~{OUT5})
NetR100_1: R100.1 U100.1(REXT)
NetR101_1: R101.1 U101.1(REXT)
NetR102_1: R102.1 U102.1(REXT)
NetR110_1: R110.1 U110.1(REXT)
NetR111_1: R111.1 U111.1(REXT)

Not connected (* = marked no-connect by the designer): U111 15(~{OUT7})

### Notes on the sheet
- 3x GS8011AR-G = 3 * 8 * 100mW = 2.4W
- 1x GS4011AG-G = 1 * 15 * 100mW = 1.5W
- 28mm 7segment: GS8011AR-G
- RextMin = 625R
- 5x TLC59108IPWR = 5 * 5V * 30mA = 0.75W
- (in symbol GS4011AG-G) a; b; c; d; e; f; g; h; j; k; i; m; n; p; DP

### Library data of the parts
C100 = CMP-14477-002194-3: as C1100 on sheet 110_ESP32s3; Packaging: Digi-Reel®; Height: 900µm; Width: 800µm; Thickness: 889µm; Min Operating Temperature: -55°C; Termination: SMD/SMT; Mount: Surface Mount; Ratings: AEC-Q200; Halogen Free: Halogen Free; Tolerance: 10%; Max Operating Temperature: 85°C; Case Code (Metric): 1608; Case/Package: 0603; Lead Free: Lead Free; Case Code (Imperial): 0603; Length: 1.6002mm; Voltage Rating: 35V; Voltage Rating (DC): 35V; Dielectric: X5R; Min Width: 700µm; Min Length: 1.5mm; Max Length: 1.7mm; Material: Ceramic; Min Thickness: 700µm; Max Thickness: 900µm; RoHS: Compliant; Max Width: 900µm
C101 = CMP-1037-05002-1: CAP 47uF 10V ±20% 1206 (3216 Metric) Thickness 1.9mm SMD; Case-Metric: 3216; Case-EIA: 1206; Tolerance: Â±20%; Technology: SMT; Rated Voltage: 10 V; Value: 47uF; Max Thickness: 1.9 mm
D100-D102 = GS8011AR-G: SMD, 28x16.8mm 7-Segment
D110 = GS4011AG-G: SMD, 19x9.3mm 14-Segment, Alphanummerical
R100-R102 R110 R111 = CMP-2000-03530-2: RES Thick Film, 680Ω, 5%, 0.1W, 200ppm/°C, 0603 / CRCW0603680RJNEA; Power Rating: 100mW; Voltage Rating: 75V; Resistance: 680R; Max Operating Temperature: 155°C; Package Quantity: 1; Features: Automotive AEC-Q200; Composition: Thick Film; Length: 1.55mm; Voltage Rating (DC): 75V; Number of Terminations: 2; Termination: SMD/SMT; Case/Package: 0603; Height: 0.45mm; Min Operating Temperature: -55°C; Case Code (Imperial): 0603; Width: 0.033inch; Military Standard: Not; Max Power Dissipation: 100mW; Lead Free: Lead Free; Weight: 7.1E-05oz; Temperature Coefficient: 200ppm/°C; Contact Plating: Tin; Packaging: Tape and Reel; Radiation Hardening: No; Working Voltage: 75V; Tolerance: 5%; Number of Pins: 2; Depth: 0.85mm; Case Code (Metric): 1608
U100-U102 U110 U111 = CMP-0388-00397-2: 8-Bit Fast Mode Plus (FM+) I2C Bus Constant-Current LED Sink Driver, 3 to 5.5 V, -40 to 85 degC, 20-pin SOP (PW20), Green (RoHS & no Sb/Br); Manufacturer: Texas Instruments; Vin(Max)(V): 5.5; Vin(Min)(V): 3; Iout(Max)(A): 0.12; SubFamily: LED Driver; ComponentLink3URL: http://www.ti.com.cn/cn/lit/ml/mpds362/mpds362.pdf; PackageVersion: 4040064-5/G; ComponentLink1URL: http://www.ti.com/; ComponentLink2Description: Datasheet; ComponentLink2URL: http://www.ti.com/general/docs/lit/getliterature.tsp?genericPartNumber=TLC59108&fileType=pdf; PackageReference: PW0020A; PackageDescription: 20-Pin Plastic Small Outline, Body 6.5 x 4.4 mm, 0.65 mm Pitch; ComponentLink1Description: Manufacturer URL; ComponentLink3Description: Package Specification; Eco-Plan: Green (RoHS & no Sb/Br); PartNumber: TLC59108IPWR; Code_JEDEC: MO-153; DatasheetVersion: SLDS156A; Mounting Technology: Surface Mount

## Sheet 30_SOC.SchDoc
size A3; SheetNumber: 4; SheetTotal: 12
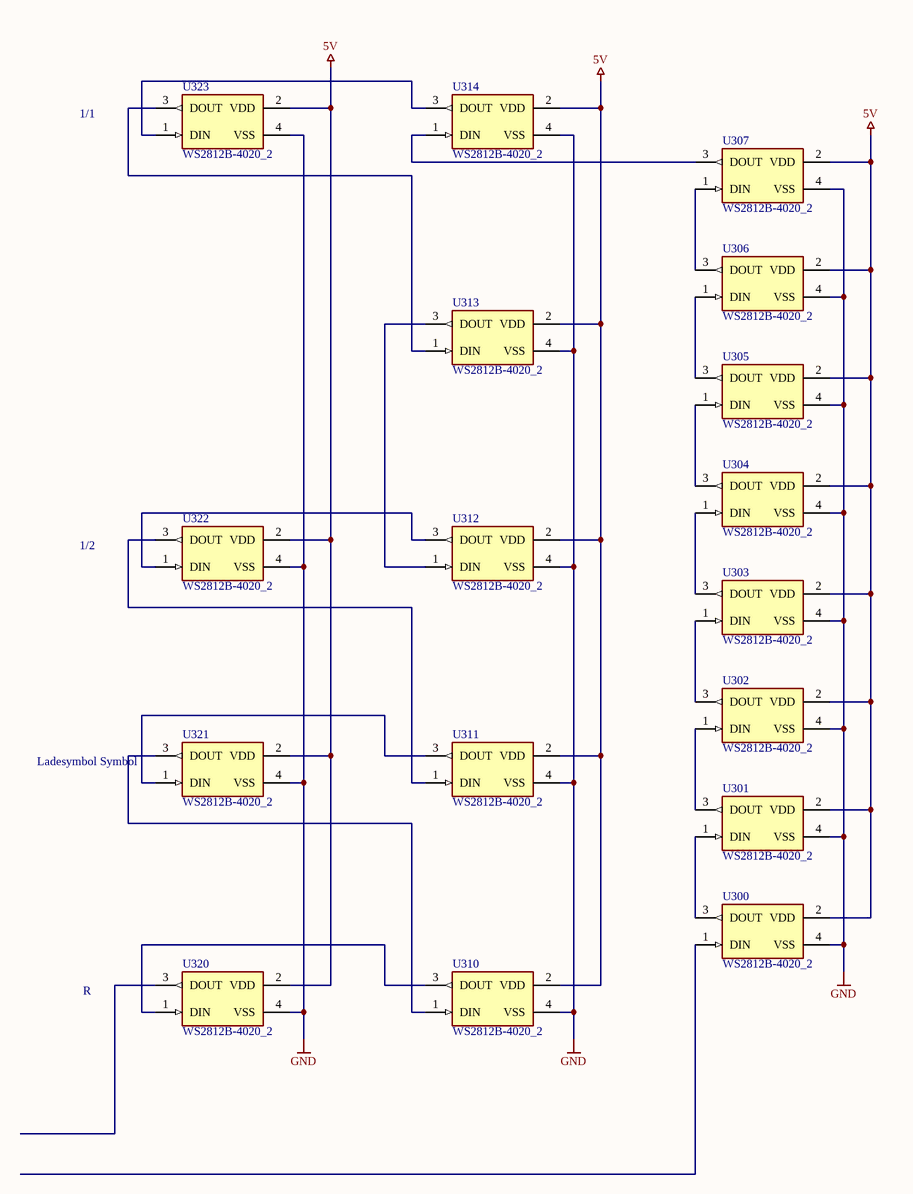
[diagram p4: 30_SOC.SchDoc]

### Parts
U300  WS2812B-4020_2  [LED_WS2812B-4020]
U301  WS2812B-4020_2  [LED_WS2812B-4020]
U302  WS2812B-4020_2  [LED_WS2812B-4020]
U303  WS2812B-4020_2  [LED_WS2812B-4020]
U304  WS2812B-4020_2  [LED_WS2812B-4020]
U305  WS2812B-4020_2  [LED_WS2812B-4020]
U306  WS2812B-4020_2  [LED_WS2812B-4020]
U307  WS2812B-4020_2  [LED_WS2812B-4020]
U310  WS2812B-4020_2  [LED_WS2812B-4020]
U311  WS2812B-4020_2  [LED_WS2812B-4020]
U312  WS2812B-4020_2  [LED_WS2812B-4020]
U313  WS2812B-4020_2  [LED_WS2812B-4020]
U314  WS2812B-4020_2  [LED_WS2812B-4020]
U320  WS2812B-4020_2  [LED_WS2812B-4020]
U321  WS2812B-4020_2  [LED_WS2812B-4020]
U322  WS2812B-4020_2  [LED_WS2812B-4020]
U323  WS2812B-4020_2  [LED_WS2812B-4020]

### Nets
5V: U300.2(VDD) U301.2(VDD) U302.2(VDD) U303.2(VDD) U304.2(VDD) U305.2(VDD) U306.2(VDD) U307.2(VDD) U310.2(VDD) U311.2(VDD) U312.2(VDD) U313.2(VDD) U314.2(VDD) U320.2(VDD) U321.2(VDD) U322.2(VDD) U323.2(VDD)
GND: U300.4(VSS) U301.4(VSS) U302.4(VSS) U303.4(VSS) U304.4(VSS) U305.4(VSS) U306.4(VSS) U307.4(VSS) U310.4(VSS) U311.4(VSS) U312.4(VSS) U313.4(VSS) U314.4(VSS) U320.4(VSS) U321.4(VSS) U322.4(VSS) U323.4(VSS)
NetU300_3: U300.3(DOUT) U301.1(DIN)
NetU301_3: U301.3(DOUT) U302.1(DIN)
NetU302_3: U302.3(DOUT) U303.1(DIN)
NetU303_3: U303.3(DOUT) U304.1(DIN)
NetU304_3: U304.3(DOUT) U305.1(DIN)
NetU305_3: U305.3(DOUT) U306.1(DIN)
NetU306_3: U306.3(DOUT) U307.1(DIN)
NetU307_3: U307.3(DOUT) U314.1(DIN)
NetU310_1: U310.1(DIN) U321.3(DOUT)
NetU310_3: U310.3(DOUT) U320.1(DIN)
NetU311_1: U311.1(DIN) U322.3(DOUT)
NetU311_3: U311.3(DOUT) U321.1(DIN)
NetU312_1: U312.1(DIN) U313.3(DOUT)
NetU312_3: U312.3(DOUT) U322.1(DIN)
NetU313_1: U313.1(DIN) U323.3(DOUT)
NetU314_3: U314.3(DOUT) U323.1(DIN)

Not connected (* = marked no-connect by the designer): U300 1(DIN); U320 3(DOUT)

### Notes on the sheet
- 1/1
- 1/2
- (near U321) Ladesymbol Symbol
- R

### Library data of the parts
U300-U307 U310-U314 U320-U323 = WS2812B-4020_2: as U204 on sheet 20_Torq; Price: None; MP: WS2812B-4020; Availability: Not in stock; SnapEDA_Link: https://www.snapeda.com/parts/WS2812B-4020/Worldsemi/view-part/?ref=snap; Check_prices: https://www.snapeda.com/parts/WS2812B-4020/Worldsemi/view-part/?ref=eda; Value: *; Package: Package

## Sheet 40_Temp.SchDoc
size A3; SheetNumber: 5; SheetTotal: 12
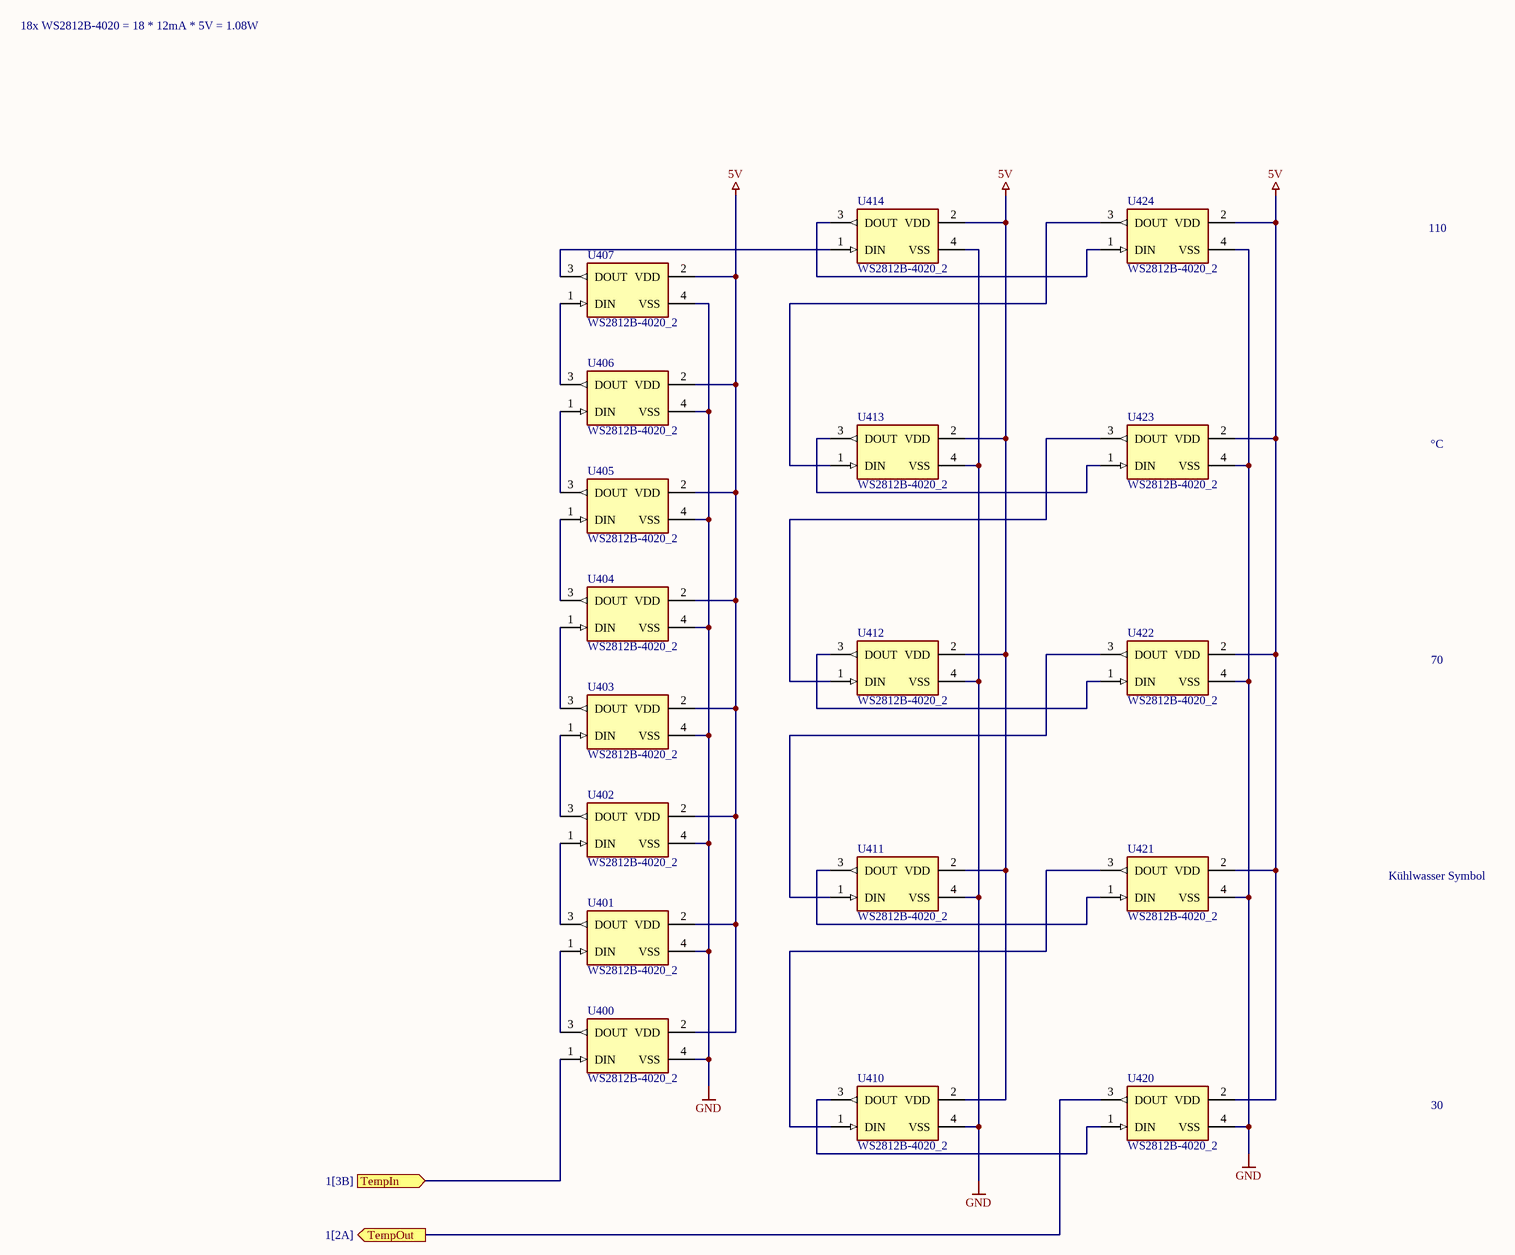
[diagram p5: 40_Temp.SchDoc]

### Parts
U400  WS2812B-4020_2  [LED_WS2812B-4020]
U401  WS2812B-4020_2  [LED_WS2812B-4020]
U402  WS2812B-4020_2  [LED_WS2812B-4020]
U403  WS2812B-4020_2  [LED_WS2812B-4020]
U404  WS2812B-4020_2  [LED_WS2812B-4020]
U405  WS2812B-4020_2  [LED_WS2812B-4020]
U406  WS2812B-4020_2  [LED_WS2812B-4020]
U407  WS2812B-4020_2  [LED_WS2812B-4020]
U410  WS2812B-4020_2  [LED_WS2812B-4020]
U411  WS2812B-4020_2  [LED_WS2812B-4020]
U412  WS2812B-4020_2  [LED_WS2812B-4020]
U413  WS2812B-4020_2  [LED_WS2812B-4020]
U414  WS2812B-4020_2  [LED_WS2812B-4020]
U420  WS2812B-4020_2  [LED_WS2812B-4020]
U421  WS2812B-4020_2  [LED_WS2812B-4020]
U422  WS2812B-4020_2  [LED_WS2812B-4020]
U423  WS2812B-4020_2  [LED_WS2812B-4020]
U424  WS2812B-4020_2  [LED_WS2812B-4020]

### Ports
TempIn (in, see 1[3B]), TempOut (out, see 1[2A])

### Nets
5V: U400.2(VDD) U401.2(VDD) U402.2(VDD) U403.2(VDD) U404.2(VDD) U405.2(VDD) U406.2(VDD) U407.2(VDD) U410.2(VDD) U411.2(VDD) U412.2(VDD) U413.2(VDD) U414.2(VDD) U420.2(VDD) U421.2(VDD) U422.2(VDD) U423.2(VDD) U424.2(VDD)
GND: U400.4(VSS) U401.4(VSS) U402.4(VSS) U403.4(VSS) U404.4(VSS) U405.4(VSS) U406.4(VSS) U407.4(VSS) U410.4(VSS) U411.4(VSS) U412.4(VSS) U413.4(VSS) U414.4(VSS) U420.4(VSS) U421.4(VSS) U422.4(VSS) U423.4(VSS) U424.4(VSS)
NetP001_2: U420.3(DOUT) ; port TempOut
NetU400_1: U400.1(DIN) ; port TempIn
NetU400_3: U400.3(DOUT) U401.1(DIN)
NetU401_3: U401.3(DOUT) U402.1(DIN)
NetU402_3: U402.3(DOUT) U403.1(DIN)
NetU403_3: U403.3(DOUT) U404.1(DIN)
NetU404_3: U404.3(DOUT) U405.1(DIN)
NetU405_3: U405.3(DOUT) U406.1(DIN)
NetU406_3: U406.3(DOUT) U407.1(DIN)
NetU407_3: U407.3(DOUT) U414.1(DIN)
NetU410_1: U410.1(DIN) U421.3(DOUT)
NetU410_3: U410.3(DOUT) U420.1(DIN)
NetU411_1: U411.1(DIN) U422.3(DOUT)
NetU411_3: U411.3(DOUT) U421.1(DIN)
NetU412_1: U412.1(DIN) U423.3(DOUT)
NetU412_3: U412.3(DOUT) U422.1(DIN)
NetU413_1: U413.1(DIN) U424.3(DOUT)
NetU413_3: U413.3(DOUT) U423.1(DIN)
NetU414_3: U414.3(DOUT) U424.1(DIN)

### Notes on the sheet
- 18x WS2812B-4020 = 18 * 12mA * 5V = 1.08W
- 110
- °C
- 70
- Kühlwasser Symbol
- 30

### Library data of the parts
U400-U407 U410-U414 U420-U424 = WS2812B-4020_2: as U204 on sheet 20_Torq; Price: None; MP: WS2812B-4020; Availability: Not in stock; SnapEDA_Link: https://www.snapeda.com/parts/WS2812B-4020/Worldsemi/view-part/?ref=snap; Check_prices: https://www.snapeda.com/parts/WS2812B-4020/Worldsemi/view-part/?ref=eda; Value: *; Package: Package

## Sheet 70_Signalleuchten.SchDoc
size A3; SheetNumber: 8; SheetTotal: 12
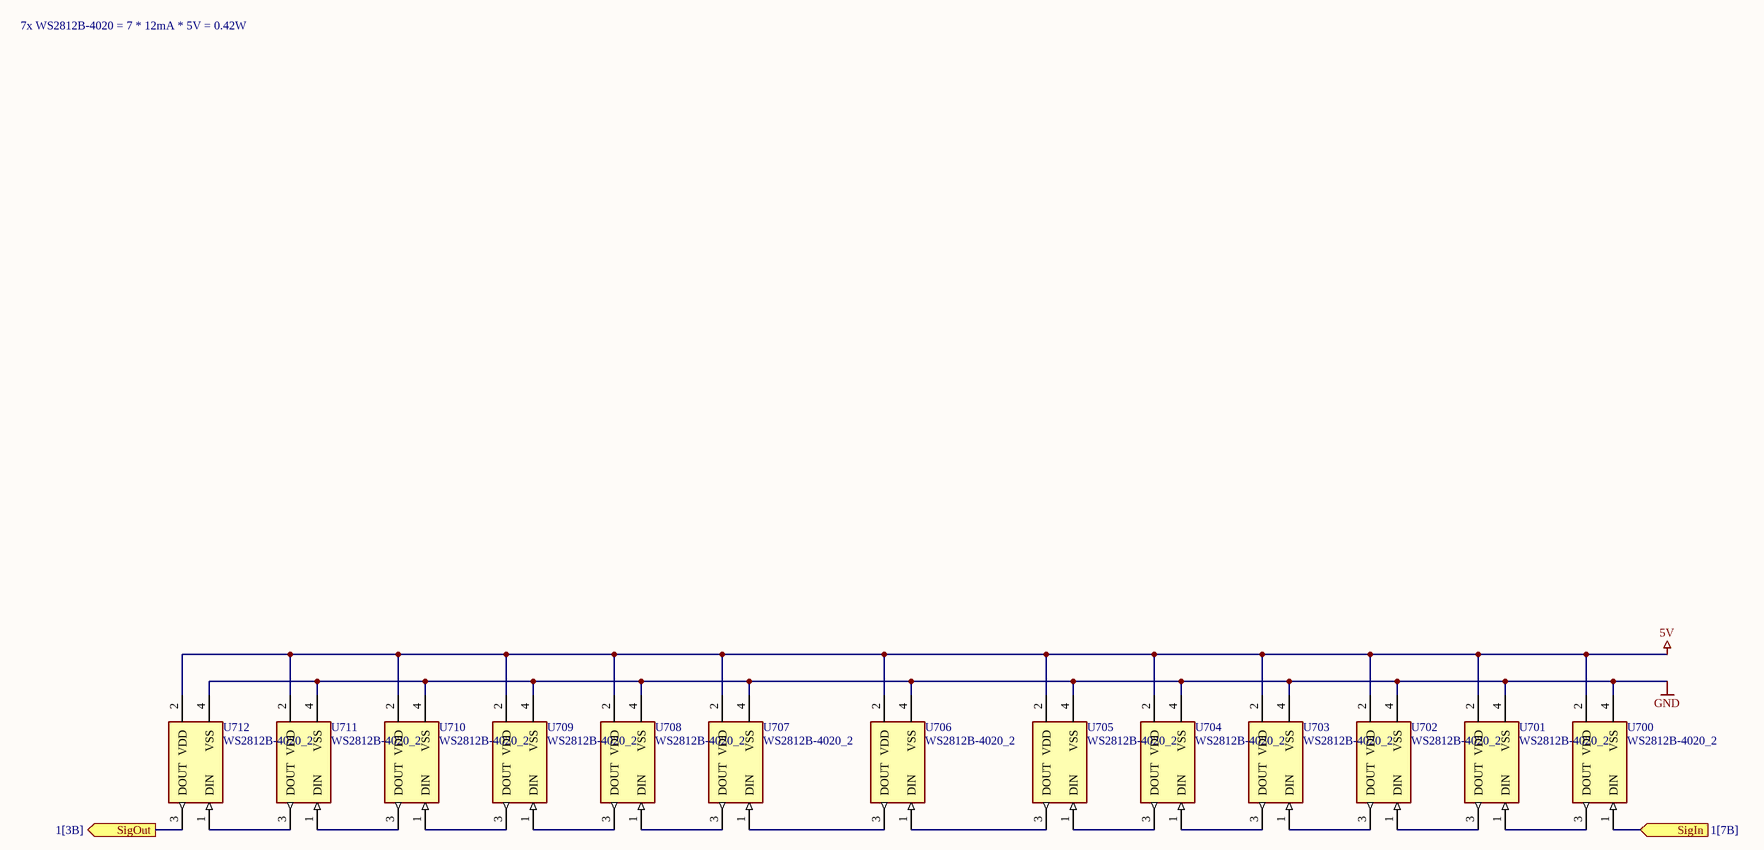
[diagram p6: 70_Signalleuchten.SchDoc]

### Parts
U700  WS2812B-4020_2  [LED_WS2812B-4020]
U701  WS2812B-4020_2  [LED_WS2812B-4020]
U702  WS2812B-4020_2  [LED_WS2812B-4020]
U703  WS2812B-4020_2  [LED_WS2812B-4020]
U704  WS2812B-4020_2  [LED_WS2812B-4020]
U705  WS2812B-4020_2  [LED_WS2812B-4020]
U706  WS2812B-4020_2  [LED_WS2812B-4020]
U707  WS2812B-4020_2  [LED_WS2812B-4020]
U708  WS2812B-4020_2  [LED_WS2812B-4020]
U709  WS2812B-4020_2  [LED_WS2812B-4020]
U710  WS2812B-4020_2  [LED_WS2812B-4020]
U711  WS2812B-4020_2  [LED_WS2812B-4020]
U712  WS2812B-4020_2  [LED_WS2812B-4020]

### Ports
SigIn (in, see 1[7B]), SigOut (out, see 1[3B])

### Nets
5V: U700.2(VDD) U701.2(VDD) U702.2(VDD) U703.2(VDD) U704.2(VDD) U705.2(VDD) U706.2(VDD) U707.2(VDD) U708.2(VDD) U709.2(VDD) U710.2(VDD) U711.2(VDD) U712.2(VDD)
GND: U700.4(VSS) U701.4(VSS) U702.4(VSS) U703.4(VSS) U704.4(VSS) U705.4(VSS) U706.4(VSS) U707.4(VSS) U708.4(VSS) U709.4(VSS) U710.4(VSS) U711.4(VSS) U712.4(VSS)
NetU400_1: U712.3(DOUT) ; port SigOut
NetU700_1: U700.1(DIN) ; port SigIn
NetU700_3: U700.3(DOUT) U701.1(DIN)
NetU701_3: U701.3(DOUT) U702.1(DIN)
NetU702_3: U702.3(DOUT) U703.1(DIN)
NetU703_3: U703.3(DOUT) U704.1(DIN)
NetU704_3: U704.3(DOUT) U705.1(DIN)
NetU705_3: U705.3(DOUT) U706.1(DIN)
NetU706_3: U706.3(DOUT) U707.1(DIN)
NetU707_3: U707.3(DOUT) U708.1(DIN)
NetU708_3: U708.3(DOUT) U709.1(DIN)
NetU709_3: U709.3(DOUT) U710.1(DIN)
NetU710_3: U710.3(DOUT) U711.1(DIN)
NetU711_3: U711.3(DOUT) U712.1(DIN)

### Notes on the sheet
- 7x WS2812B-4020 = 7 * 12mA * 5V = 0.42W

### Library data of the parts
U700-U712 = WS2812B-4020_2: as U204 on sheet 20_Torq; Price: None; MP: WS2812B-4020; Availability: Not in stock; SnapEDA_Link: https://www.snapeda.com/parts/WS2812B-4020/Worldsemi/view-part/?ref=snap; Check_prices: https://www.snapeda.com/parts/WS2812B-4020/Worldsemi/view-part/?ref=eda; Value: *; Package: Package

## Sheet 50_Distance.SchDoc
size A3; SheetNumber: 6; SheetTotal: 11
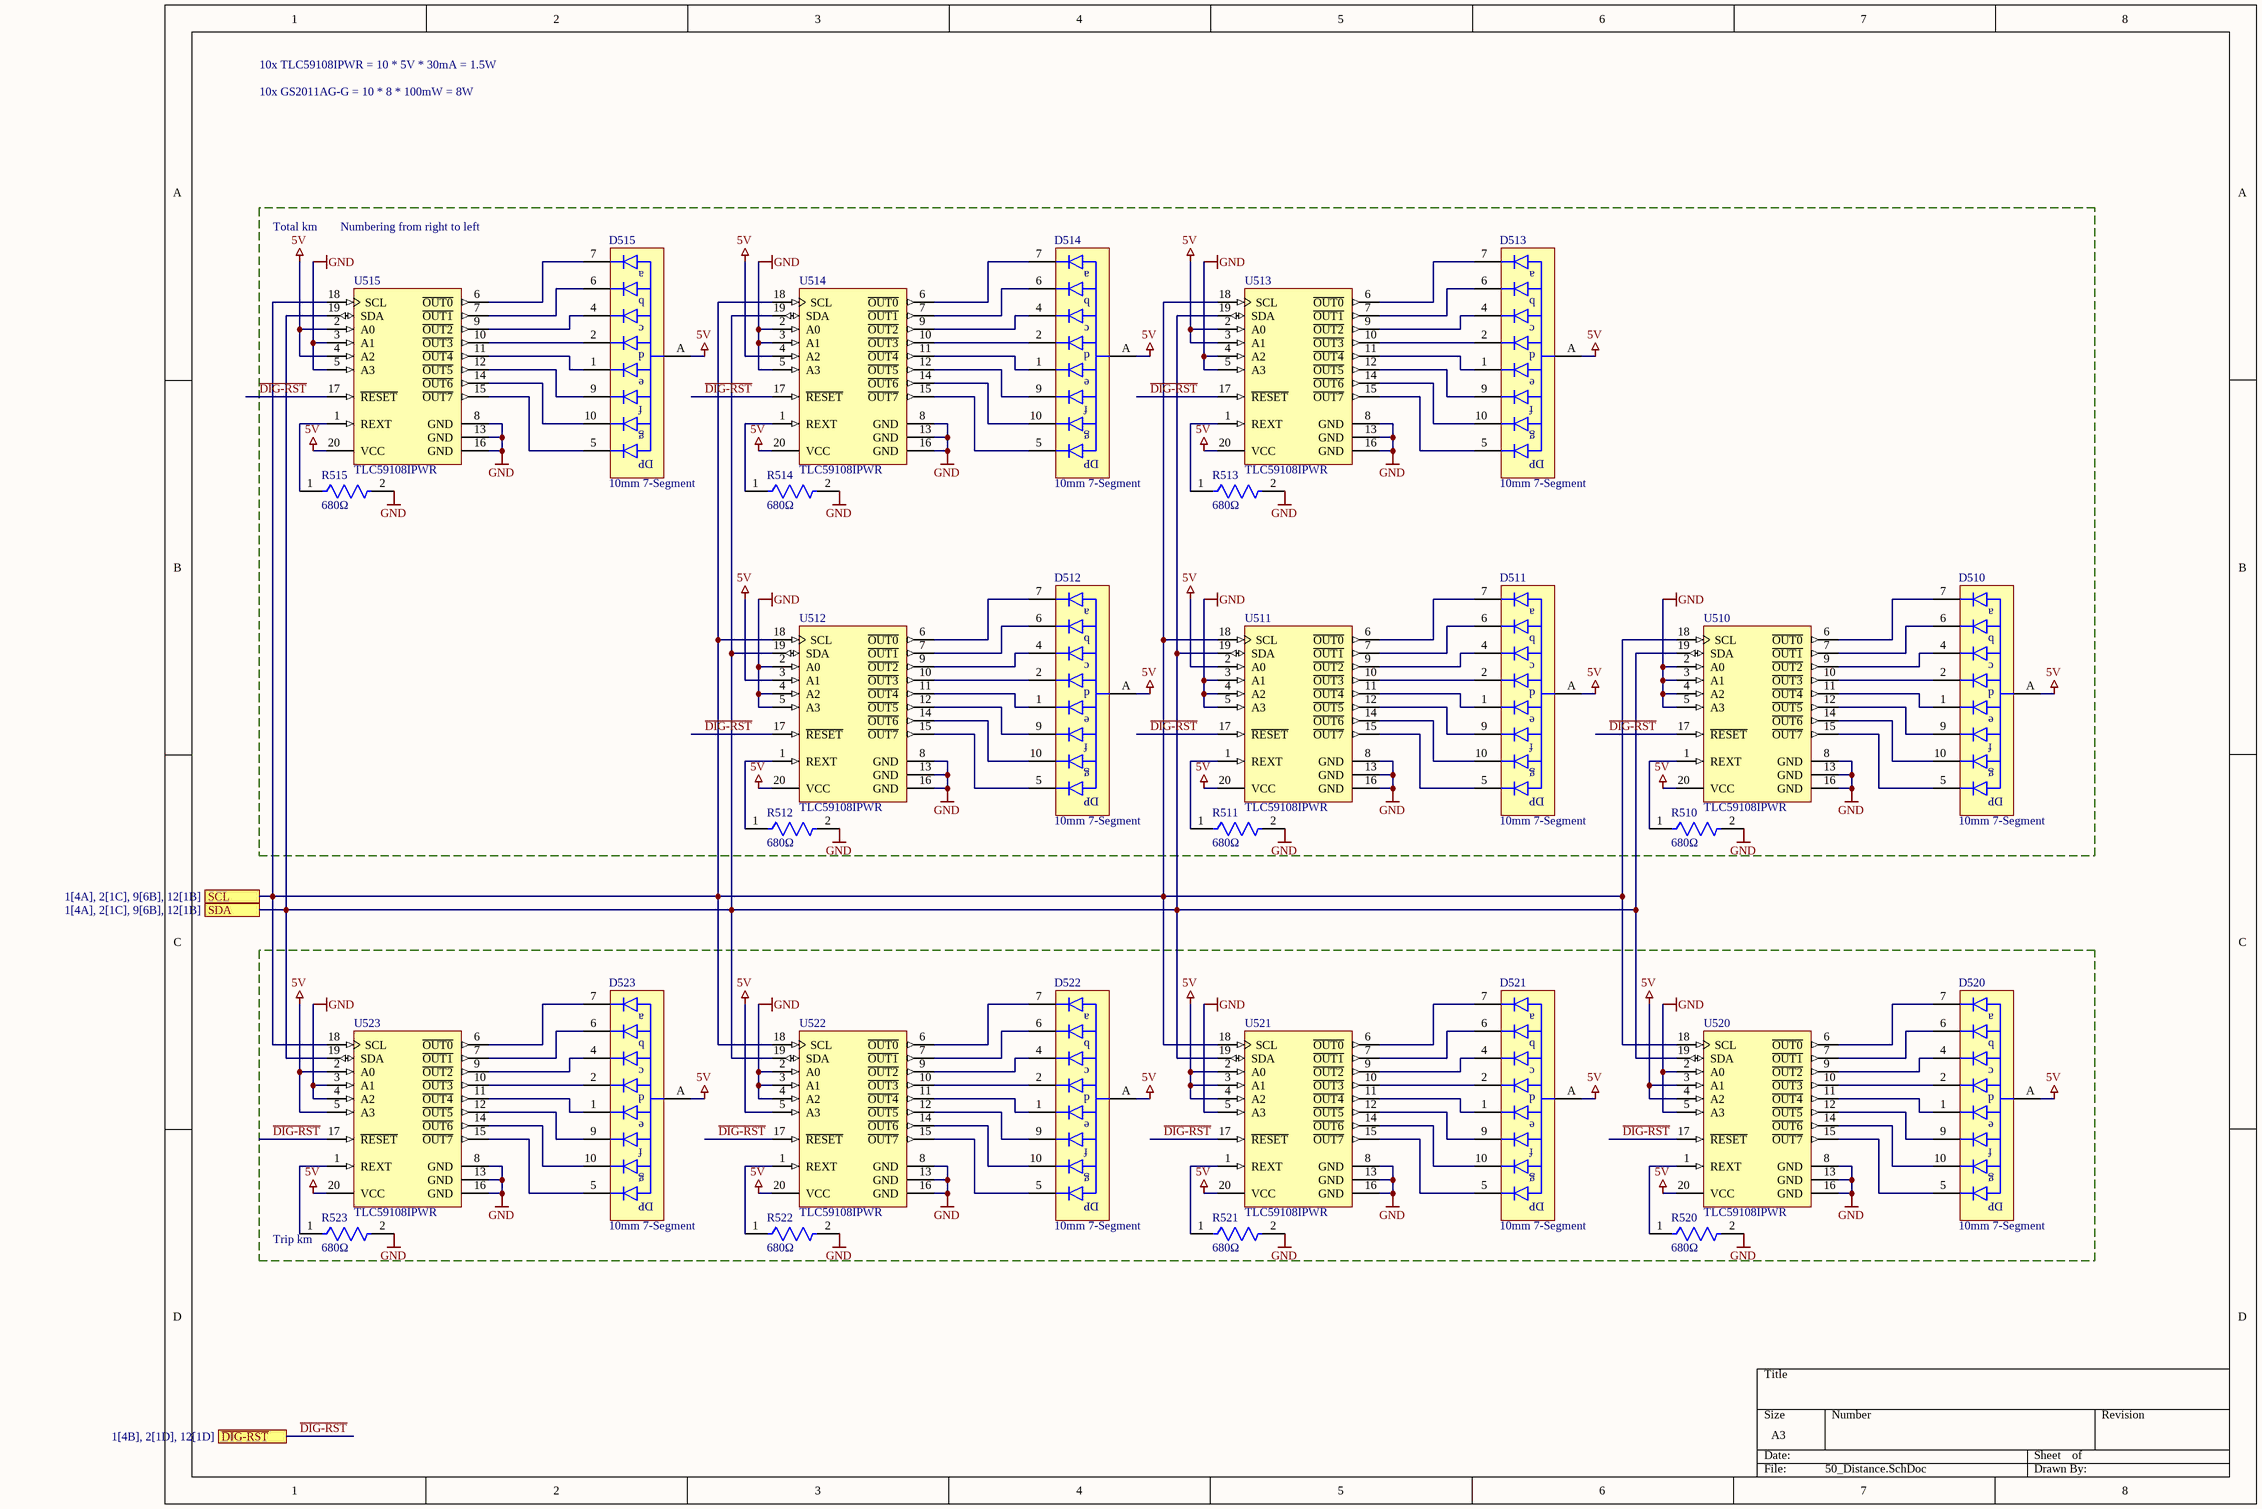
[diagram p7: 50_Distance.SchDoc]

### Parts
D510  10mm 7-Segment  [GS2011AG-G]
D511  10mm 7-Segment  [GS2011AG-G]
D512  10mm 7-Segment  [GS2011AG-G]
D513  10mm 7-Segment  [GS2011AG-G]
D514  10mm 7-Segment  [GS2011AG-G]
D515  10mm 7-Segment  [GS2011AG-G]
D520  10mm 7-Segment  [GS2011AG-G]
D521  10mm 7-Segment  [GS2011AG-G]
D522  10mm 7-Segment  [GS2011AG-G]
D523  10mm 7-Segment  [GS2011AG-G]
R510  680Ω  [FP-CRCW0603-e3-IPC_A]
R511  680Ω  [FP-CRCW0603-e3-IPC_A]
R512  680Ω  [FP-CRCW0603-e3-IPC_A]
R513  680Ω  [FP-CRCW0603-e3-IPC_A]
R514  680Ω  [FP-CRCW0603-e3-IPC_A]
R515  680Ω  [FP-CRCW0603-e3-IPC_A]
R520  680Ω  [FP-CRCW0603-e3-IPC_A]
R521  680Ω  [FP-CRCW0603-e3-IPC_A]
R522  680Ω  [FP-CRCW0603-e3-IPC_A]
R523  680Ω  [FP-CRCW0603-e3-IPC_A]
U510  TLC59108IPWR  [PW0020A_M]
U511  TLC59108IPWR  [PW0020A_M]
U512  TLC59108IPWR  [PW0020A_M]
U513  TLC59108IPWR  [PW0020A_M]
U514  TLC59108IPWR  [PW0020A_M]
U515  TLC59108IPWR  [PW0020A_M]
U520  TLC59108IPWR  [PW0020A_M]
U521  TLC59108IPWR  [PW0020A_M]
U522  TLC59108IPWR  [PW0020A_M]
U523  TLC59108IPWR  [PW0020A_M]

### Blocks framed on the sheet
Trip km: D520-D523 R520-R523 U520-U523

### Ports
SCL (see 1[4A], 2[1C], 9[6B], 12[1B]), SDA (see 1[4A], 2[1C], 9[6B], 12[1B]), ~{DIG-RST} (see 1[4B], 2[1D], 12[1D])

### Nets
5V: D510.A D511.A D512.A D513.A D514.A D515.A D520.A D521.A D522.A D523.A U510.20(VCC) U511.2(A0) U511.20(VCC) U512.3(A1) U512.20(VCC) U513.2(A0) U513.3(A1) U513.20(VCC) U514.4(A2) U514.20(VCC) U515.2(A0) U515.4(A2) U515.20(VCC) U520.3(A1) U520.4(A2) U520.20(VCC) U521.2(A0) U521.3(A1) U521.4(A2) U521.20(VCC) U522.5(A3) U522.20(VCC) U523.2(A0) U523.5(A3) U523.20(VCC)
GND: R510.2 R511.2 R512.2 R513.2 R514.2 R515.2 R520.2 R521.2 R522.2 R523.2 U510.2(A0) U510.3(A1) U510.4(A2) U510.5(A3) U510.8(GND) U510.13(GND) U510.16(GND) U511.3(A1) U511.4(A2) U511.5(A3) U511.8(GND) U511.13(GND) U511.16(GND) U512.2(A0) U512.4(A2) U512.5(A3) U512.8(GND) U512.13(GND) U512.16(GND) U513.4(A2) U513.5(A3) U513.8(GND) U513.13(GND) U513.16(GND) U514.2(A0) U514.3(A1) U514.5(A3) U514.8(GND) U514.13(GND) U514.16(GND) U515.3(A1) U515.5(A3) U515.8(GND) U515.13(GND) U515.16(GND) U520.2(A0) U520.5(A3) U520.8(GND) U520.13(GND) U520.16(GND) U521.5(A3) U521.8(GND) U521.13(GND) U521.16(GND) U522.2(A0) U522.3(A1) U522.4(A2) U522.8(GND) U522.13(GND) U522.16(GND) U523.3(A1) U523.4(A2) U523.8(GND) U523.13(GND) U523.16(GND)
~{DIG-RST}: U510.17(~{RESET}) U511.17(~{RESET}) U512.17(~{RESET}) U513.17(~{RESET}) U514.17(~{RESET}) U515.17(~{RESET}) U520.17(~{RESET}) U521.17(~{RESET}) U522.17(~{RESET}) U523.17(~{RESET}) ; port ~{DIG-RST}
SCL: U510.18(SCL) U511.18(SCL) U512.18(SCL) U513.18(SCL) U514.18(SCL) U515.18(SCL) U520.18(SCL) U521.18(SCL) U522.18(SCL) U523.18(SCL) ; port SCL
SDA: U510.19(SDA) U511.19(SDA) U512.19(SDA) U513.19(SDA) U514.19(SDA) U515.19(SDA) U520.19(SDA) U521.19(SDA) U522.19(SDA) U523.19(SDA) ; port SDA
NetD510_1: D510.1 U510.11(~{OUT4})
NetD510_2: D510.2 U510.10(~{OUT3})
NetD510_4: D510.4 U510.9(~{OUT2})
NetD510_5: D510.5 U510.15(~{OUT7})
NetD510_6: D510.6 U510.7(~{OUT1})
NetD510_7: D510.7 U510.6(~{OUT0})
NetD510_9: D510.9 U510.12(~{OUT5})
NetD510_10: D510.10 U510.14(~{OUT6})
NetD511_1: D511.1 U511.11(~{OUT4})
NetD511_2: D511.2 U511.10(~{OUT3})
NetD511_4: D511.4 U511.9(~{OUT2})
NetD511_5: D511.5 U511.15(~{OUT7})
NetD511_6: D511.6 U511.7(~{OUT1})
NetD511_7: D511.7 U511.6(~{OUT0})
NetD511_9: D511.9 U511.12(~{OUT5})
NetD511_10: D511.10 U511.14(~{OUT6})
NetD512_1: D512.1 U512.11(~{OUT4})
NetD512_2: D512.2 U512.10(~{OUT3})
NetD512_4: D512.4 U512.9(~{OUT2})
NetD512_5: D512.5 U512.15(~{OUT7})
NetD512_6: D512.6 U512.7(~{OUT1})
NetD512_7: D512.7 U512.6(~{OUT0})
NetD512_9: D512.9 U512.12(~{OUT5})
NetD512_10: D512.10 U512.14(~{OUT6})
NetD513_1: D513.1 U513.11(~{OUT4})
NetD513_2: D513.2 U513.10(~{OUT3})
NetD513_4: D513.4 U513.9(~{OUT2})
NetD513_5: D513.5 U513.15(~{OUT7})
NetD513_6: D513.6 U513.7(~{OUT1})
NetD513_7: D513.7 U513.6(~{OUT0})
NetD513_9: D513.9 U513.12(~{OUT5})
NetD513_10: D513.10 U513.14(~{OUT6})
NetD514_1: D514.1 U514.11(~{OUT4})
NetD514_2: D514.2 U514.10(~{OUT3})
NetD514_4: D514.4 U514.9(~{OUT2})
NetD514_5: D514.5 U514.15(~{OUT7})
NetD514_6: D514.6 U514.7(~{OUT1})
NetD514_7: D514.7 U514.6(~{OUT0})
NetD514_9: D514.9 U514.12(~{OUT5})
NetD514_10: D514.10 U514.14(~{OUT6})
NetD515_1: D515.1 U515.11(~{OUT4})
NetD515_2: D515.2 U515.10(~{OUT3})
NetD515_4: D515.4 U515.9(~{OUT2})
NetD515_5: D515.5 U515.15(~{OUT7})
NetD515_6: D515.6 U515.7(~{OUT1})
NetD515_7: D515.7 U515.6(~{OUT0})
NetD515_9: D515.9 U515.12(~{OUT5})
NetD515_10: D515.10 U515.14(~{OUT6})
NetD520_1: D520.1 U520.11(~{OUT4})
NetD520_2: D520.2 U520.10(~{OUT3})
NetD520_4: D520.4 U520.9(~{OUT2})
NetD520_5: D520.5 U520.15(~{OUT7})
NetD520_6: D520.6 U520.7(~{OUT1})
NetD520_7: D520.7 U520.6(~{OUT0})
NetD520_9: D520.9 U520.12(~{OUT5})
NetD520_10: D520.10 U520.14(~{OUT6})
NetD521_1: D521.1 U521.11(~{OUT4})
NetD521_2: D521.2 U521.10(~{OUT3})
NetD521_4: D521.4 U521.9(~{OUT2})
NetD521_5: D521.5 U521.15(~{OUT7})
NetD521_6: D521.6 U521.7(~{OUT1})
NetD521_7: D521.7 U521.6(~{OUT0})
NetD521_9: D521.9 U521.12(~{OUT5})
NetD521_10: D521.10 U521.14(~{OUT6})
NetD522_1: D522.1 U522.11(~{OUT4})
NetD522_2: D522.2 U522.10(~{OUT3})
NetD522_4: D522.4 U522.9(~{OUT2})
NetD522_5: D522.5 U522.15(~{OUT7})
NetD522_6: D522.6 U522.7(~{OUT1})
NetD522_7: D522.7 U522.6(~{OUT0})
NetD522_9: D522.9 U522.12(~{OUT5})
NetD522_10: D522.10 U522.14(~{OUT6})
NetD523_1: D523.1 U523.11(~{OUT4})
NetD523_2: D523.2 U523.10(~{OUT3})
NetD523_4: D523.4 U523.9(~{OUT2})
NetD523_5: D523.5 U523.15(~{OUT7})
NetD523_6: D523.6 U523.7(~{OUT1})
NetD523_7: D523.7 U523.6(~{OUT0})
NetD523_9: D523.9 U523.12(~{OUT5})
NetD523_10: D523.10 U523.14(~{OUT6})
NetR510_1: R510.1 U510.1(REXT)
NetR511_1: R511.1 U511.1(REXT)
NetR512_1: R512.1 U512.1(REXT)
NetR513_1: R513.1 U513.1(REXT)
NetR514_1: R514.1 U514.1(REXT)
NetR515_1: R515.1 U515.1(REXT)
NetR520_1: R520.1 U520.1(REXT)
NetR521_1: R521.1 U521.1(REXT)
NetR522_1: R522.1 U522.1(REXT)
NetR523_1: R523.1 U523.1(REXT)

### Notes on the sheet
- 10x TLC59108IPWR = 10 * 5V * 30mA = 1.5W
- 10x GS2011AG-G = 10 * 8 * 100mW = 8W
- Total km
- Numbering from right to left
- (in symbol GS2011AG-G) a; b; c; d; e; f; g; DP

### Library data of the parts
D510-D515 D520-D523 = GS2011AG-G: SMD, 10x6.9mm 7-Segment
R510-R515 R520-R523 = CMP-2000-03530-2: as R100 on sheet 10_Speed; Max Operating Temperature: 155°C; Package Quantity: 1; Features: Automotive AEC-Q200; Composition: Thick Film; Length: 1.55mm; Voltage Rating (DC): 75V; Number of Terminations: 2; Termination: SMD/SMT; Case/Package: 0603; Height: 0.45mm; Min Operating Temperature: -55°C; Case Code (Imperial): 0603; Width: 0.033inch; Military Standard: Not; Max Power Dissipation: 100mW; Lead Free: Lead Free; Weight: 7.1E-05oz; Temperature Coefficient: 200ppm/°C; Contact Plating: Tin; Packaging: Tape and Reel; Radiation Hardening: No; Working Voltage: 75V; Tolerance: 5%; Number of Pins: 2; Depth: 0.85mm; Case Code (Metric): 1608
U510-U515 U520-U523 = CMP-0388-00397-2: as U100 on sheet 10_Speed; ComponentLink3URL: http://www.ti.com.cn/cn/lit/ml/mpds362/mpds362.pdf; PackageVersion: 4040064-5/G; ComponentLink1URL: http://www.ti.com/; ComponentLink2Description: Datasheet; ComponentLink2URL: http://www.ti.com/general/docs/lit/getliterature.tsp?genericPartNumber=TLC59108&fileType=pdf; PackageReference: PW0020A; PackageDescription: 20-Pin Plastic Small Outline, Body 6.5 x 4.4 mm, 0.65 mm Pitch; ComponentLink1Description: Manufacturer URL; ComponentLink3Description: Package Specification; Eco-Plan: Green (RoHS & no Sb/Br); PartNumber: TLC59108IPWR; Code_JEDEC: MO-153; DatasheetVersion: SLDS156A; Mounting Technology: Surface Mount

## Sheet 60_Inkremental.SchDoc
size A3; SheetNumber: 7; SheetTotal: 11
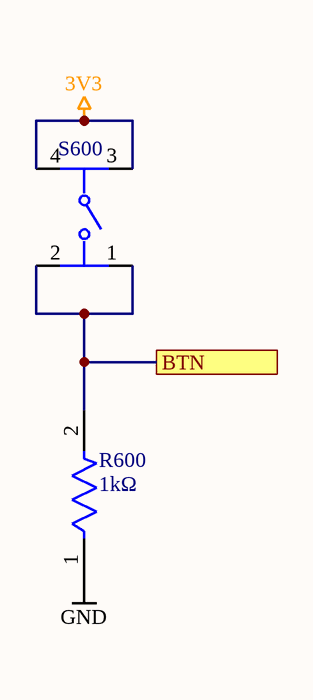
[diagram p8: 60_Inkremental.SchDoc]

### Parts
R600  1kΩ  [FP-CRCW0603-e3-MFG]
S600  (no value)  [FP-PTS645SM43SMTR92LFS-MFG]

### Ports
BTN (see 1[3A], 12[1B])

### Nets
3V3: S600.3 S600.4
GND: R600.1
NetR600_2: R600.2 S600.1 S600.2 ; port BTN

### Library data of the parts
R600 = CMP-1666-00003-5: as R1100 on sheet 110_ESP32s3; Max Operating Temperature: 155°C; Number of Pins: 2; Case Code (Imperial): 0603; Width: 0.033inch; Power Rating: 100mW; Number of Terminations: 2; Package Quantity: 10; Weight: 7.1E-05oz; Tolerance: 1%; Temperature Coefficient: 100ppm/°C; Military Standard: Not; Mount: Surface Mount; Voltage Rating (DC): 75V; Depth: 0.85mm; Composition: Thick Film; Radiation Hardening: No; Termination: SMD/SMT; Length: 1.55mm; Case Code (Metric): 1608; Contact Plating: Tin; Min Operating Temperature: -55°C; Packaging: Tape and Reel; Height: 0.45mm; Lead Free: Lead Free; Case/Package: 0603; Features: Automotive AEC-Q200
S600 = CMP-2000-05160-2: as S1100 on sheet 110_ESP32s3; Min Operating Temperature: -20°C; REACH SVHC: No SVHC; Termination: Gull Wing; Case/Package: SMD/SMT; Packaging: Tape and Reel; Mount: Surface Mount; Voltage Rating (DC): 12V; Orientation: Straight; Lead Free: Lead Free; Contact Material: Silver; Color: Black; Max Current Rating: 50mA; Contact Plating: Silver; Depth: 9mm; Package Quantity: 1; Max Voltage Rating (DC): 12V; Length: 6mm; Max Operating Temperature: 60°C

## Sheet 80_SignalInput.SchDoc
size A3; SheetNumber: 9; SheetTotal: 12
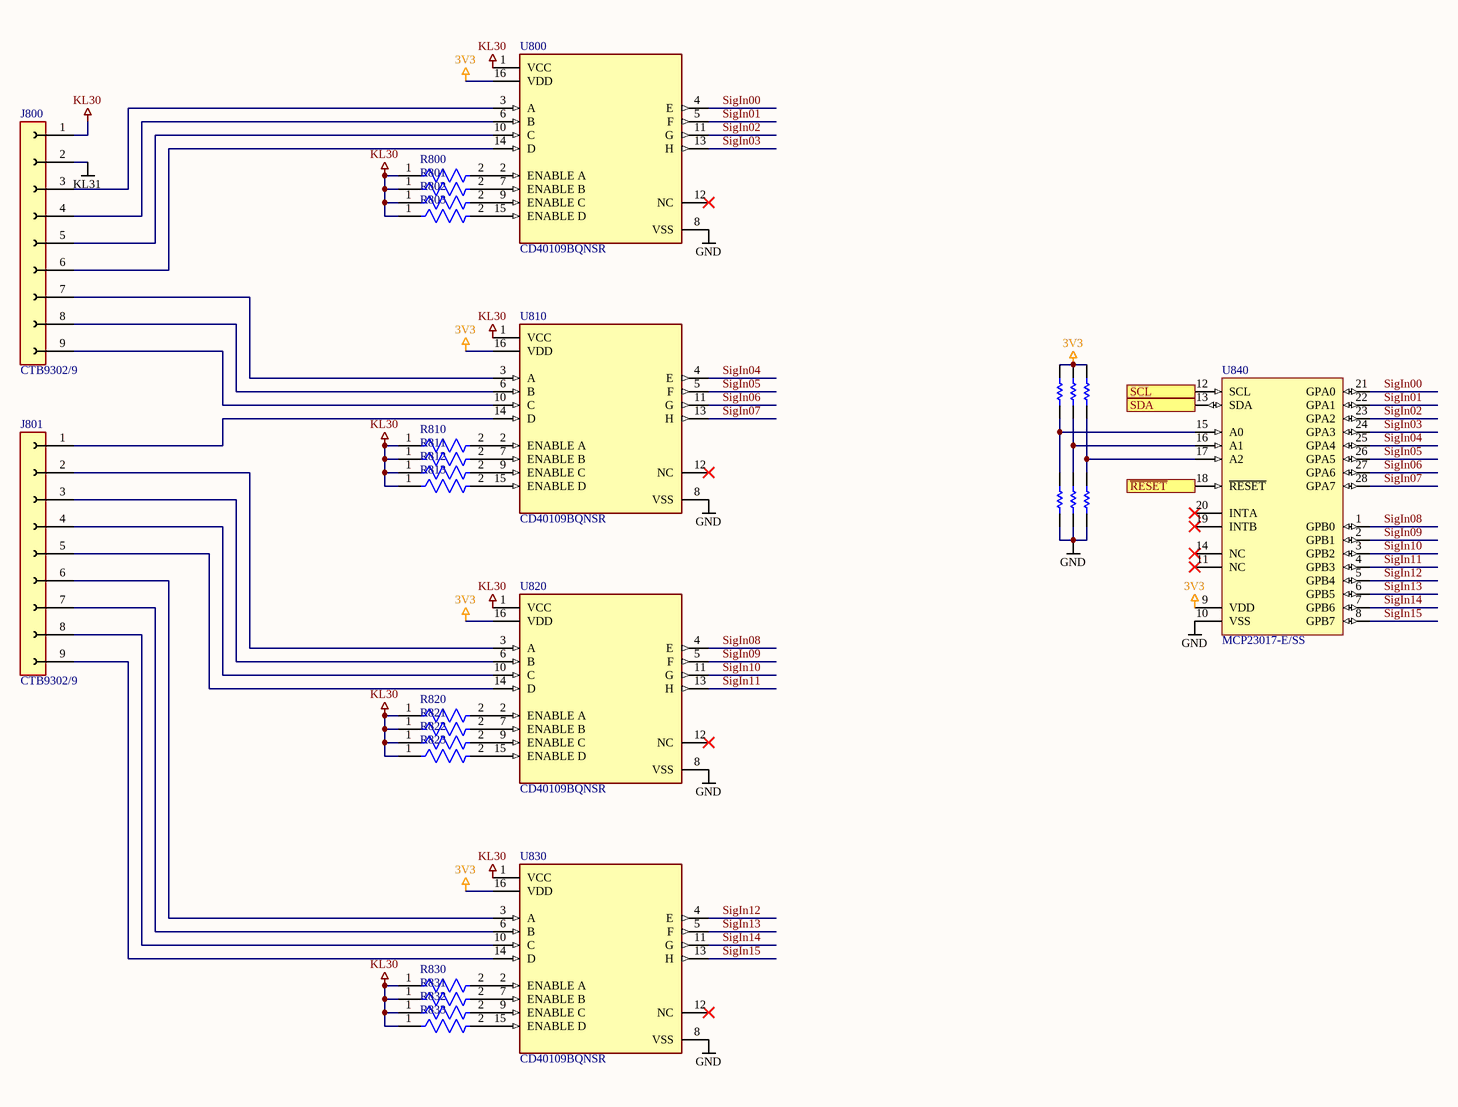
[diagram p9: 80_SignalInput.SchDoc]

### Parts
J800  CTB9302/9  [CTB9302-9]
J801  CTB9302/9  [CTB9302-9]
R800  AC0603FR-071KL  [FP-AC0603-IPC_B]  (value not drawn)
R801  AC0603FR-071KL  [FP-AC0603-IPC_B]  (value not drawn)
R802  AC0603FR-071KL  [FP-AC0603-IPC_B]  (value not drawn)
R803  AC0603FR-071KL  [FP-AC0603-IPC_B]  (value not drawn)
R810  AC0603FR-071KL  [FP-AC0603-IPC_B]  (value not drawn)
R811  AC0603FR-071KL  [FP-AC0603-IPC_B]  (value not drawn)
R812  AC0603FR-071KL  [FP-AC0603-IPC_B]  (value not drawn)
R813  AC0603FR-071KL  [FP-AC0603-IPC_B]  (value not drawn)
R820  AC0603FR-071KL  [FP-AC0603-IPC_B]  (value not drawn)
R821  AC0603FR-071KL  [FP-AC0603-IPC_B]  (value not drawn)
R822  AC0603FR-071KL  [FP-AC0603-IPC_B]  (value not drawn)
R823  AC0603FR-071KL  [FP-AC0603-IPC_B]  (value not drawn)
R830  AC0603FR-071KL  [FP-AC0603-IPC_B]  (value not drawn)
R831  AC0603FR-071KL  [FP-AC0603-IPC_B]  (value not drawn)
R832  AC0603FR-071KL  [FP-AC0603-IPC_B]  (value not drawn)
R833  AC0603FR-071KL  [FP-AC0603-IPC_B]  (value not drawn)
R840  RC0603JR-070RL  [RESC1608X55X25ML10T15]  (value not drawn)  (no BOM)
R841  RC0603JR-070RL  [RESC1608X55X25ML10T15]  (value not drawn)  (no BOM)
R842  RC0603JR-070RL  [RESC1608X55X25ML10T15]  (value not drawn)  (no BOM)
R843  RC0603JR-070RL  [RESC1608X55X25ML10T15]  (value not drawn)  (no BOM)
R844  RC0603JR-070RL  [RESC1608X55X25ML10T15]  (value not drawn)  (no BOM)
R845  RC0603JR-070RL  [RESC1608X55X25ML10T15]  (value not drawn)  (no BOM)
U800  CD40109BQNSR  [FP-NS0016A-IPC_C]
U810  CD40109BQNSR  [FP-NS0016A-IPC_C]
U820  CD40109BQNSR  [FP-NS0016A-IPC_C]
U830  CD40109BQNSR  [FP-NS0016A-IPC_C]
U840  MCP23017-E/SS  [SSOP-SS28_N]

### Ports
SCL (see 1[4C], 2[1C], 6[1C], 12[1B]), SDA (see 1[4C], 2[1C], 6[1C], 12[1B]), ~{RESET} (see 1[4C], 12[2D])

### Nets
3V3: R840.2 R841.2 R842.2 U800.16(VDD) U810.16(VDD) U820.16(VDD) U830.16(VDD) U840.9(VDD)
GND: R843.1 R844.1 R845.1 U800.8(VSS) U810.8(VSS) U820.8(VSS) U830.8(VSS) U840.10(VSS)
KL30: J800.1 R800.1 R801.1 R802.1 R803.1 R810.1 R811.1 R812.1 R813.1 R820.1 R821.1 R822.1 R823.1 R830.1 R831.1 R832.1 R833.1 U800.1(VCC) U810.1(VCC) U820.1(VCC) U830.1(VCC)
KL31: J800.2
SCL: U840.12(SCL) ; port SCL
SDA: U840.13(SDA) ; port SDA
SigIn00: U800.4(E) U840.21(GPA0)
SigIn01: U800.5(F) U840.22(GPA1)
SigIn02: U800.11(G) U840.23(GPA2)
SigIn03: U800.13(H) U840.24(GPA3)
SigIn04: U810.4(E) U840.25(GPA4)
SigIn05: U810.5(F) U840.26(GPA5)
SigIn06: U810.11(G) U840.27(GPA6)
SigIn07: U810.13(H) U840.28(GPA7)
SigIn08: U820.4(E) U840.1(GPB0)
SigIn09: U820.5(F) U840.2(GPB1)
SigIn10: U820.11(G) U840.3(GPB2)
SigIn11: U820.13(H) U840.4(GPB3)
SigIn12: U830.4(E) U840.5(GPB4)
SigIn13: U830.5(F) U840.6(GPB5)
SigIn14: U830.11(G) U840.7(GPB6)
SigIn15: U830.13(H) U840.8(GPB7)
NetJ800_3: J800.3 U800.3(A)
NetJ800_4: J800.4 U800.6(B)
NetJ800_5: J800.5 U800.10(C)
NetJ800_6: J800.6 U800.14(D)
NetJ800_7: J800.7 U810.3(A)
NetJ800_8: J800.8 U810.6(B)
NetJ800_9: J800.9 U810.10(C)
NetJ801_1: J801.1 U810.14(D)
NetJ801_2: J801.2 U820.3(A)
NetJ801_3: J801.3 U820.6(B)
NetJ801_4: J801.4 U820.10(C)
NetJ801_5: J801.5 U820.14(D)
NetJ801_6: J801.6 U830.3(A)
NetJ801_7: J801.7 U830.6(B)
NetJ801_8: J801.8 U830.10(C)
NetJ801_9: J801.9 U830.14(D)
NetQ1104_3: U840.18(~{RESET}) ; port ~{RESET}
NetR800_2: R800.2 U800.2(ENABLE_A)
NetR801_2: R801.2 U800.7(ENABLE_B)
NetR802_2: R802.2 U800.9(ENABLE_C)
NetR803_2: R803.2 U800.15(ENABLE_D)
NetR810_2: R810.2 U810.2(ENABLE_A)
NetR811_2: R811.2 U810.7(ENABLE_B)
NetR812_2: R812.2 U810.9(ENABLE_C)
NetR813_2: R813.2 U810.15(ENABLE_D)
NetR820_2: R820.2 U820.2(ENABLE_A)
NetR821_2: R821.2 U820.7(ENABLE_B)
NetR822_2: R822.2 U820.9(ENABLE_C)
NetR823_2: R823.2 U820.15(ENABLE_D)
NetR830_2: R830.2 U830.2(ENABLE_A)
NetR831_2: R831.2 U830.7(ENABLE_B)
NetR832_2: R832.2 U830.9(ENABLE_C)
NetR833_2: R833.2 U830.15(ENABLE_D)
NetR840_1: R840.1 R843.2 U840.15(A0)
NetR841_1: R841.1 R844.2 U840.16(A1)
NetR842_1: R842.1 R845.2 U840.17(A2)

Not connected (* = marked no-connect by the designer): U800 12(NC)*; U810 12(NC)*; U820 12(NC)*; U830 12(NC)*; U840 11(NC)* 14(NC)* 19(INTB)* 20(INTA)*

### Library data of the parts
J800 J801 = CTB9302-9: CTB9302/9 - Stiftleiste - 9-pol, RM 5 mm, 0°
R800-R803 R810-R813 R820-R823 R830-R833 = CMP-2000-04828-3: RES 1kΩ 1.00% 0.1W 0603; Voltage Rating: 50V; Power Rating: 100mW; Tolerance: 1%; Temperature Coefficient: 100ppm/°C; Resistance: 1kR; Depth: 0.8mm; Case/Package: 0603; Size Code: 0603; Case Code (Metric): 1608; Height: 0.022inch; Series: AC; Width: 0.031inch; Construction: Rectangular; Length: 0.063inch; Case Code (Imperial): 0603; Package Quantity: 1; RoHS Compliant: Yes; Features: Moisture Resistant; Resistor Type: Thick Film; Max Power Dissipation: 100mW; Packaging: Tape and Reel; Termination: SMD/SMT; Ratings: AEC-Q200; Max Operating Temperature: 155°C; Min Operating Temperature: -55°C; Military Standard: Not; Lead Free: Lead Free; Number of Terminations: 2
R840-R845 = CMP-2100-03667-1: as R000 on sheet 00_Overview; Width: 0.8mm; Max Operating Temperature: 155degC; Tolerance: 5%; Package Reference: 0603; Height: 0.45mm; Depth: 0.8mm; Package Description: 2-Pin Surface Mount Device, Body 1.6 x 0.8 mm; Termination: SMD/SMT; Package Quantity: 5000; Case/Package: 0603; Case Code (Imperial): 0603; Radiation Hardening: No; Number of Pins: 2; Length: 1.6mm; Lead Free: LeadFree; Voltage Rating (DC): 50V; Military Standard: Not; Datasheet URL: http://www.yageo.com/NewPortal/yageodocoutput?fileName=/pdf/R-Chip/PYu-RC_Group_51_RoHS_L_5.pdf; Manufacturer URL: http://www.yageo.com/; Packaging: TapeandReel; Case Code (Metric): 1608; Min Operating Temperature: -55degC; Composition: ThickFilm; RoHSCompliant: true; Contact Plating: Tin; Datasheet Version: Rev. 5, 10/2016; REACH SVHC: NoSVHC
U800 U810 U820 U830 = CMP-04899-000094-1: IC TRNSLTR UNIDIRECTIONAL 16SO; Max Supply Voltage: 18V; Number of Channels: 4; Propagation Delay: 240ns; High Level Output Current: -4mA; Logic Function: Level Shifter; Turn-On Delay Time: 740ns; Data Rate: 10Mbps; Min Supply Voltage: 3V; Low Level Output Current: 4mA; Quiescent Current: 20uA; Output Type: Voltage; Packaging: Tape and Reel; Mount: Surface Mount; Contact Plating: Gold; Min Operating Temperature: -40°C; Number of Circuits: 4; Lead Free: Lead Free; Max Operating Temperature: 125°C; Radiation Hardening: No; Channel Type: Unidirectional; RoHS Compliant: Yes; Series: 4000B; Package Quantity: 2000; Number of Pins: 16; Technology: CMOS; Case/Package: SOP; Number of Bits: 4
U840 = CMP-0186-00176-2: 16-Bit I/O Expander with Serial Interface, 28-Pin SSOP, Extended Temperature; PackageVersion: revBB, Aug-2009; ComponentLink1Description: Manufacturer URL; ComponentLink3Description: Package Specification; PackageDescription: 28-Lead Plastic Shrink Small Outline (SS) - 5.3mm Body [SSOP]; ComponentLink1URL: http://www.microchip.com/; Code_JEDEC: MS-150; RevisionNote: URLs added.; ComponentLink3URL: http://www.microchip.com/stellent/groups/techpub_sg/documents/packagingspec/en012702.pdf; ComponentLink2URL: http://ww1.microchip.com/downloads/en/DeviceDoc/21952b.pdf; ComponentLink2Description: Datasheet; PackageReference: SSOP-SS28; DatasheetVersion: revB, Feb-2007